# Altium project 20K Control Board V1.1.PrjPCB (part 5 of 6)

## Sheet CPU M.SchDoc
size A2
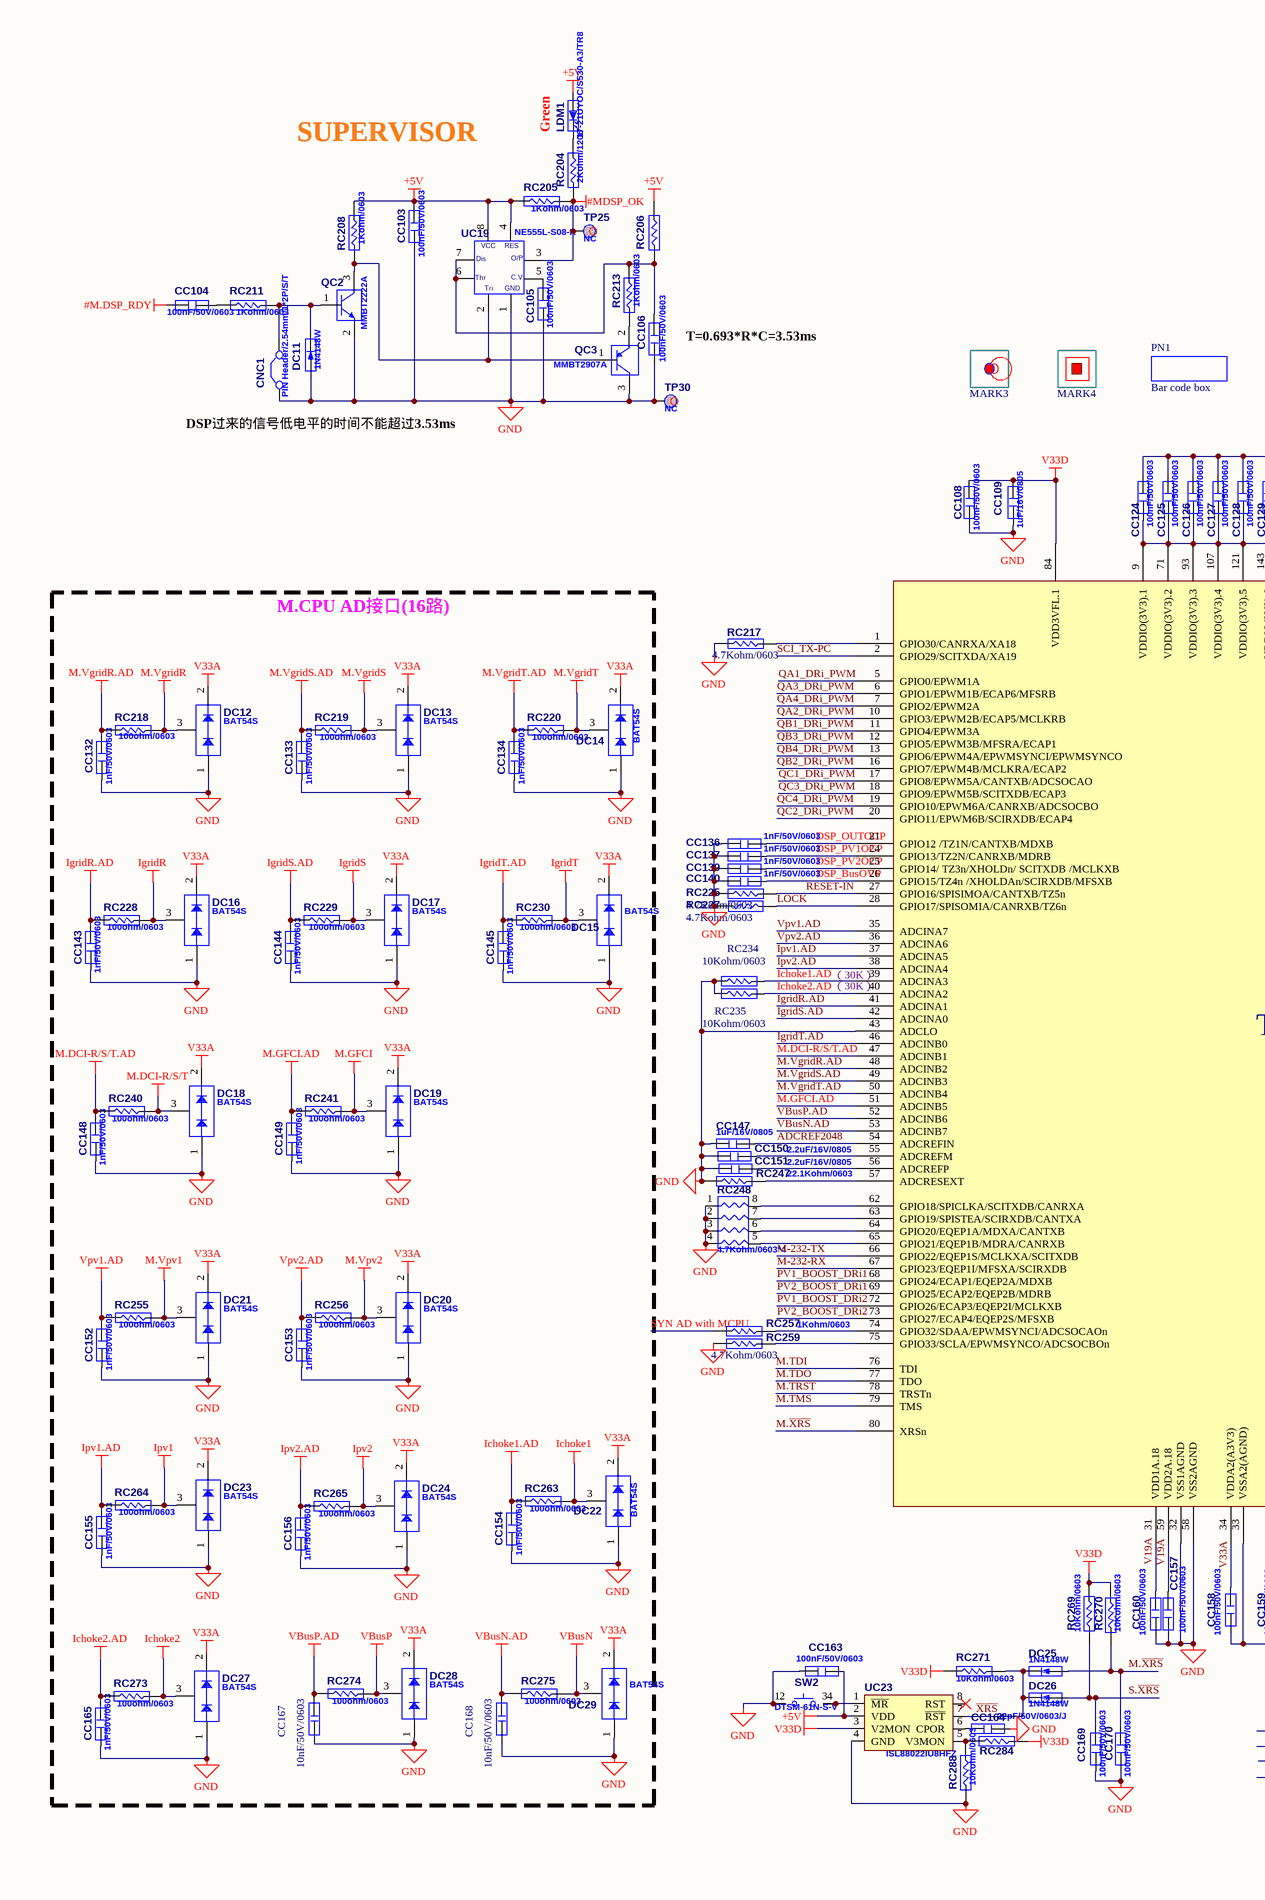
[diagram p7: CPU M.SchDoc, left]
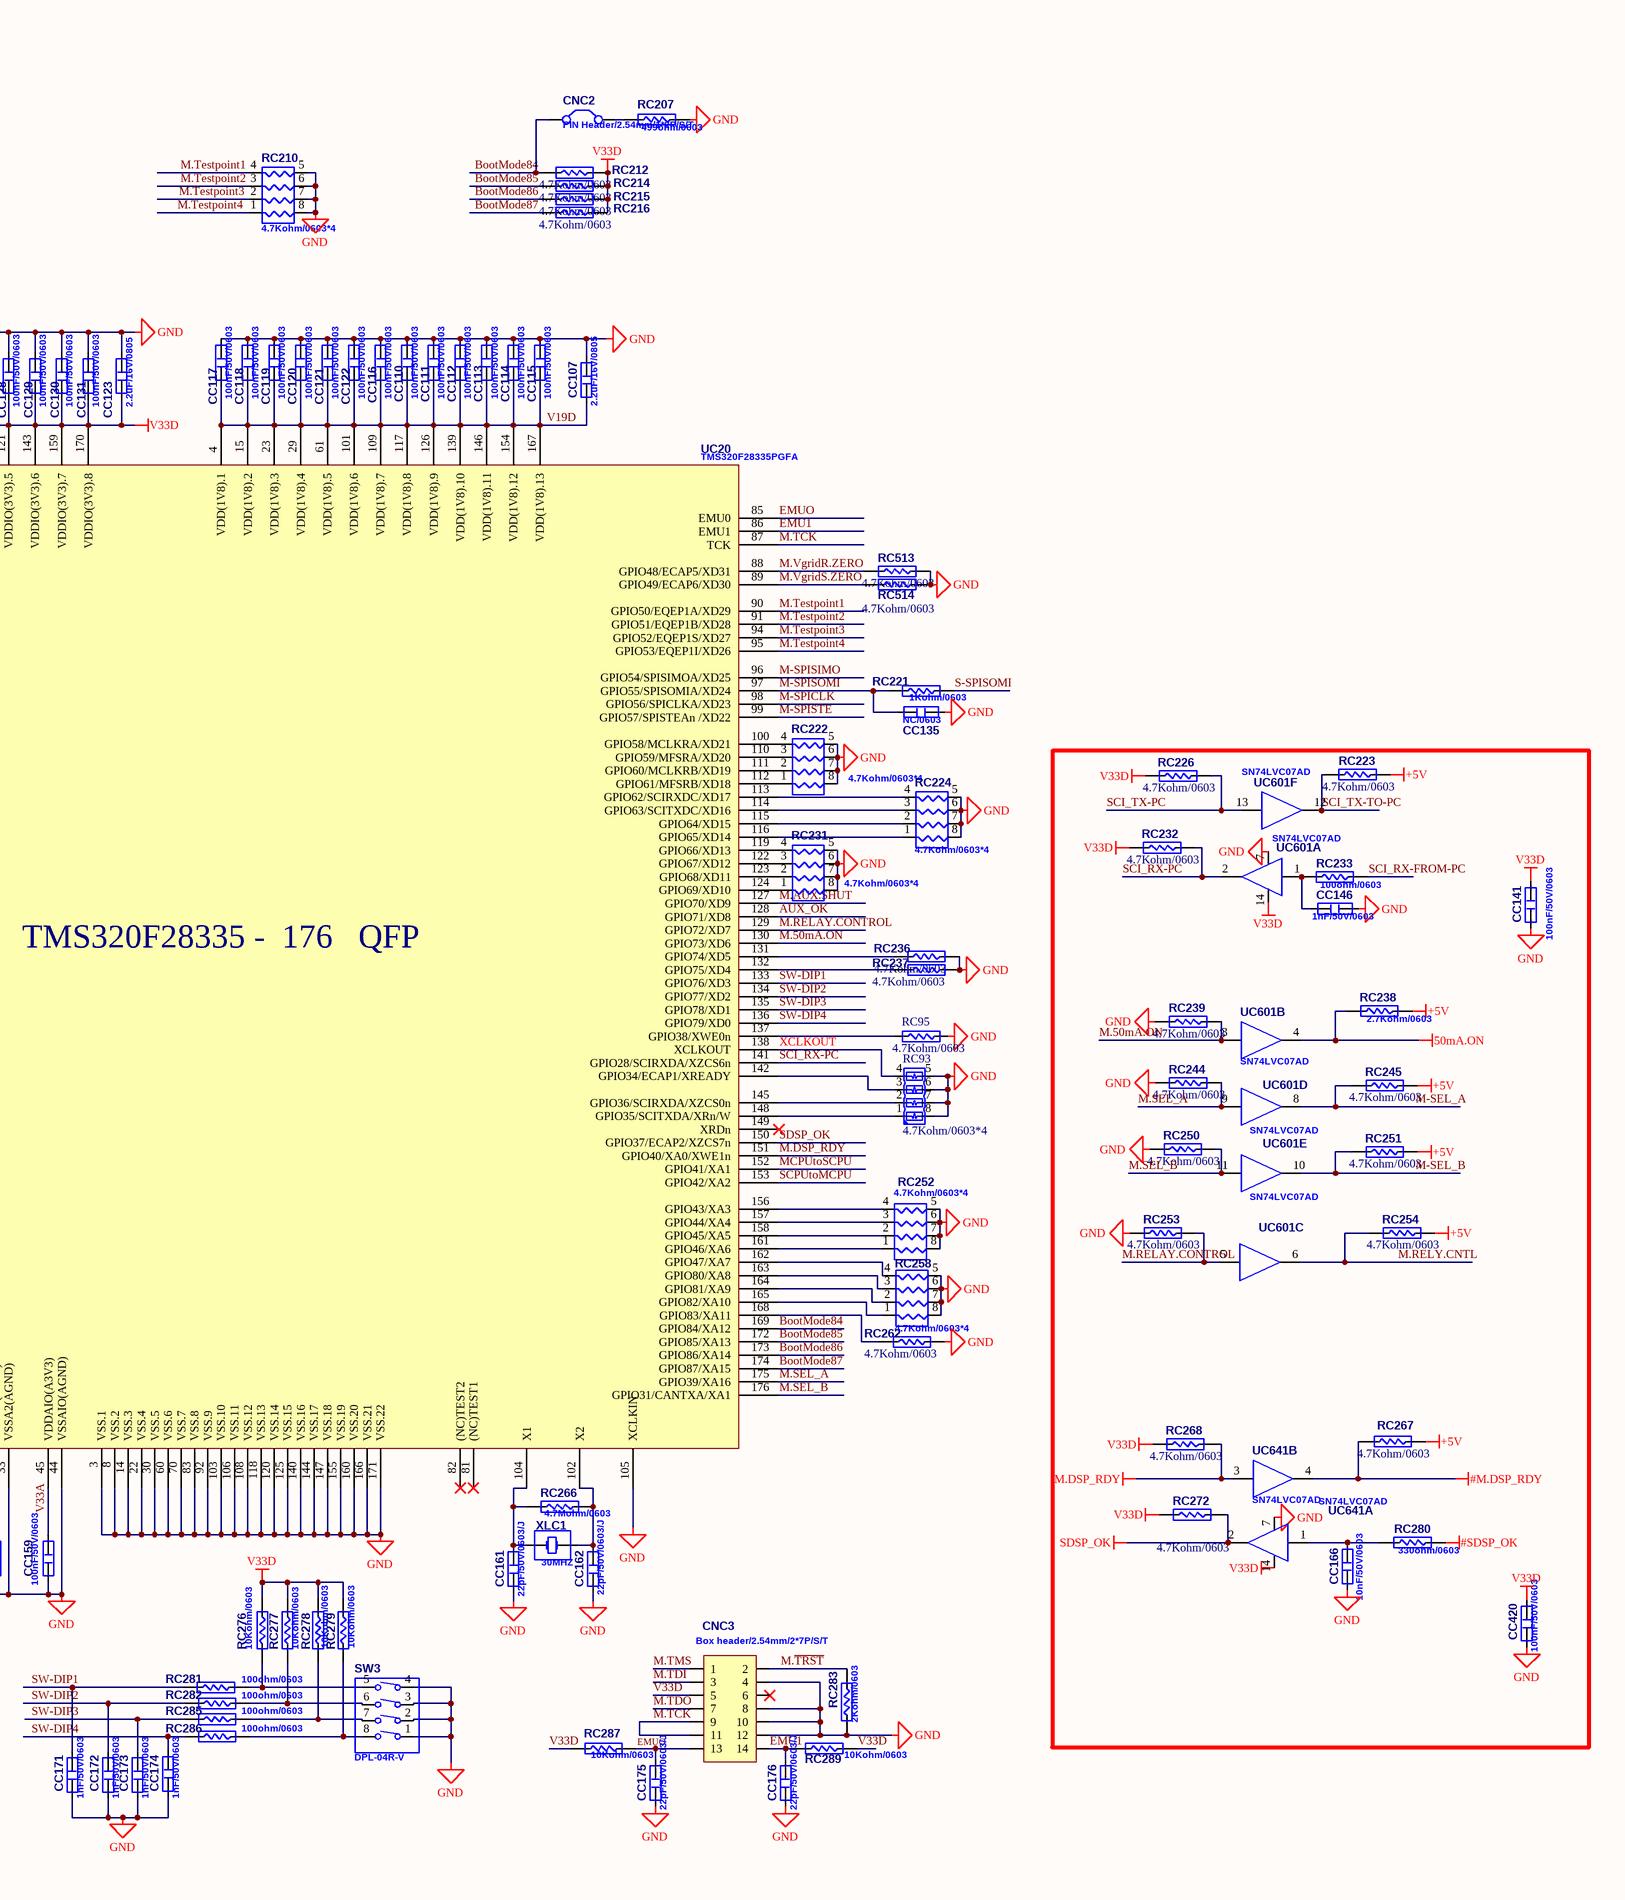
[diagram p8: CPU M.SchDoc, right]

### Parts
CC103  value 100nF/50V/0603  [CC1608-0603]  (hidden comment: 023-105220-0)
CC104  value 100nF/50V/0603  [CC1608-0603]  (hidden comment: 023-105220-0)
CC105  value 100nF/50V/0603  [CC1608-0603]  (hidden comment: 023-105220-0)
CC106  value 100nF/50V/0603  [CC1608-0603]  (hidden comment: 023-105220-0)
CC107  value 2.2uF/16V/0805  [CC2012-0805]  (hidden comment: 023-225330-0)
CC108  value 100nF/50V/0603  [CC1608-0603]  (hidden comment: 023-105220-0)
CC109  value 1uF/16V/0805  [CC2012-0805]  (hidden comment: 023-105330-0)
CC110  value 100nF/50V/0603  [CC1608-0603]  (hidden comment: 023-105220-0)
CC111  value 100nF/50V/0603  [CC1608-0603]  (hidden comment: 023-105220-0)
CC112  value 100nF/50V/0603  [CC1608-0603]  (hidden comment: 023-105220-0)
CC113  value 100nF/50V/0603  [CC1608-0603]  (hidden comment: 023-105220-0)
CC114  value 100nF/50V/0603  [CC1608-0603]  (hidden comment: 023-105220-0)
CC115  value 100nF/50V/0603  [CC1608-0603]  (hidden comment: 023-105220-0)
CC116  value 100nF/50V/0603  [CC1608-0603]  (hidden comment: 023-105220-0)
CC117  value 100nF/50V/0603  [CC1608-0603]  (hidden comment: 023-105220-0)
CC118  value 100nF/50V/0603  [CC1608-0603]  (hidden comment: 023-105220-0)
CC119  value 100nF/50V/0603  [CC1608-0603]  (hidden comment: 023-105220-0)
CC120  value 100nF/50V/0603  [CC1608-0603]  (hidden comment: 023-105220-0)
CC121  value 100nF/50V/0603  [CC1608-0603]  (hidden comment: 023-105220-0)
CC122  value 100nF/50V/0603  [CC1608-0603]  (hidden comment: 023-105220-0)
CC123  value 2.2uF/16V/0805  [CC2012-0805]  (hidden comment: 023-225330-0)
CC124  value 100nF/50V/0603  [CC1608-0603]  (hidden comment: 023-105220-0)
CC125  value 100nF/50V/0603  [CC1608-0603]  (hidden comment: 023-105220-0)
CC126  value 100nF/50V/0603  [CC1608-0603]  (hidden comment: 023-105220-0)
CC127  value 100nF/50V/0603  [CC1608-0603]  (hidden comment: 023-105220-0)
CC128  value 100nF/50V/0603  [CC1608-0603]  (hidden comment: 023-105220-0)
CC129  value 100nF/50V/0603  [CC1608-0603]  (hidden comment: 023-105220-0)
CC130  value 100nF/50V/0603  [CC1608-0603]  (hidden comment: 023-105220-0)
CC131  value 100nF/50V/0603  [CC1608-0603]  (hidden comment: 023-105220-0)
CC132  value 1nF/50V/0603  [CC1608-0603]  (hidden comment: 023-102220-0)
CC133  value 1nF/50V/0603  [CC1608-0603]  (hidden comment: 023-102220-0)
CC134  value 1nF/50V/0603  [CC1608-0603]  (hidden comment: 023-102220-0)
CC135  NC/0603  [CC1608-0603]
CC136  value 1nF/50V/0603  [CC1608-0603]  (hidden comment: 023-102220-0)
CC137  value 1nF/50V/0603  [CC1608-0603]  (hidden comment: 023-102220-0)
CC139  value 1nF/50V/0603  [CC1608-0603]  (hidden comment: 023-102220-0)
CC140  value 1nF/50V/0603  [CC1608-0603]  (hidden comment: 023-102220-0)
CC141  value 100nF/50V/0603  [CC1608-0603]  (hidden comment: 023-105220-0)
CC143  value 1nF/50V/0603  [CC1608-0603]  (hidden comment: 023-102220-0)
CC144  value 1nF/50V/0603  [CC1608-0603]  (hidden comment: 023-102220-0)
CC145  value 1nF/50V/0603  [CC1608-0603]  (hidden comment: 023-102220-0)
CC146  value 1nF/50V/0603  [CC1608-0603]  (hidden comment: 023-102220-0)
CC147  value 1uF/16V/0805  [CC2012-0805]  (hidden comment: 023-105330-0)
CC148  value 1nF/50V/0603  [CC1608-0603]  (hidden comment: 023-102220-0)
CC149  value 1nF/50V/0603  [CC1608-0603]  (hidden comment: 023-102220-0)
CC150  value 2.2uF/16V/0805  [CC2012-0805]  (hidden comment: 023-225330-0)
CC151  value 2.2uF/16V/0805  [CC2012-0805]  (hidden comment: 023-225330-0)
CC152  value 1nF/50V/0603  [CC1608-0603]  (hidden comment: 023-102220-0)
CC153  value 1nF/50V/0603  [CC1608-0603]  (hidden comment: 023-102220-0)
CC154  value 1nF/50V/0603  [CC1608-0603]  (hidden comment: 023-102220-0)
CC155  value 1nF/50V/0603  [CC1608-0603]  (hidden comment: 023-102220-0)
CC156  value 1nF/50V/0603  [CC1608-0603]  (hidden comment: 023-102220-0)
CC157  value 100nF/50V/0603  [CC1608-0603]  (hidden comment: 023-105220-0)
CC158  value 100nF/50V/0603  [CC1608-0603]  (hidden comment: 023-105220-0)
CC159  value 100nF/50V/0603  [CC1608-0603]  (hidden comment: 023-105220-0)
CC160  value 100nF/50V/0603  [CC1608-0603]  (hidden comment: 023-105220-0)
CC161  value 22pF/50V/0603/J  [CC1608-0603]  (hidden comment: 023-220220-0)
CC162  value 22pF/50V/0603/J  [CC1608-0603]  (hidden comment: 023-220220-0)
CC163  value 100nF/50V/0603  [CC1608-0603]  (hidden comment: 023-105220-0)
CC164  value 22pF/50V/0603/J  [CC1608-0603]  (hidden comment: 023-220220-0)
CC165  value 1nF/50V/0603  [CC1608-0603]  (hidden comment: 023-102220-0)
CC166  value 10nF/50V/0603  [CC1608-0603]  (hidden comment: 023-103220-0)
CC167  value 10nF/50V/0603  [C0603SM]  (hidden comment: 023-103220-0)
CC168  value 10nF/50V/0603  [C0603SM]  (hidden comment: 023-103220-0)
CC169  value 100nF/50V/0603  [CC1608-0603]  (hidden comment: 023-105220-0)
CC170  value 100nF/50V/0603  [CC1608-0603]  (hidden comment: 023-105220-0)
CC171  value 1nF/50V/0603  [CC1608-0603]  (hidden comment: 023-102220-0)
CC172  value 1nF/50V/0603  [CC1608-0603]  (hidden comment: 023-102220-0)
CC173  value 1nF/50V/0603  [CC1608-0603]  (hidden comment: 023-102220-0)
CC174  value 1nF/50V/0603  [CC1608-0603]  (hidden comment: 023-102220-0)
CC175  value 22pF/50V/0603/J  [CC1608-0603]  (hidden comment: 023-220220-0)
CC176  value 22pF/50V/0603/J  [CC1608-0603]  (hidden comment: 023-220220-0)
CC420  value 100nF/50V/0603  [CC1608-0603]  (hidden comment: 023-105220-0)
CNC1  value PIN Header/2.54mm/1*2P/S/T  [CN-SIP2.54-2P]  (hidden comment: 110-300001-0)
CNC2  value PIN Header/2.54mm/1*2P/S/T  [CN-SIP2.54-2P]  (hidden comment: 110-300001-0)
CNC3  value Box header/2.54mm/2*7P/S/T  [CN2.54-2*7P]  (hidden comment: 110-100000-0)
DC11  value 1N4148W  [SOD-123]  (hidden comment: 060-500010-0)
DC12  value BAT54S  [SOT-23]  (hidden comment: 060-510000-0)
DC13  value BAT54S  [SOT-23]  (hidden comment: 060-510000-0)
DC14  value BAT54S  [SOT-23]  (hidden comment: 060-510000-0)
DC15  value BAT54S  [SOT-23]  (hidden comment: 060-510000-0)
DC16  value BAT54S  [SOT-23]  (hidden comment: 060-510000-0)
DC17  value BAT54S  [SOT-23]  (hidden comment: 060-510000-0)
DC18  value BAT54S  [SOT-23]  (hidden comment: 060-510000-0)
DC19  value BAT54S  [SOT-23]  (hidden comment: 060-510000-0)
DC20  value BAT54S  [SOT-23]  (hidden comment: 060-510000-0)
DC21  value BAT54S  [SOT-23]  (hidden comment: 060-510000-0)
DC22  value BAT54S  [SOT-23]  (hidden comment: 060-510000-0)
DC23  value BAT54S  [SOT-23]  (hidden comment: 060-510000-0)
DC24  value BAT54S  [SOT-23]  (hidden comment: 060-510000-0)
DC25  value 1N4148W  [SOD-123]  (hidden comment: 060-500010-0)
DC26  value 1N4148W  [SOD-123]  (hidden comment: 060-500010-0)
DC27  value BAT54S  [SOT-23]  (hidden comment: 060-510000-0)
DC28  value BAT54S  [SOT-23]  (hidden comment: 060-510000-0)
DC29  value BAT54S  [SOT-23]  (hidden comment: 060-510000-0)
LDM1  value 17-21UYOC/S530-A3/TR8  [LED2012-0805SM]  (hidden comment: 060-010010-0)
MARK3  NC  [MARK_A]  (value not drawn)
MARK4  NC  [MARK_B]  (value not drawn)
PN1  Bar code box  [Bar code box]
QC2  value MMBT2222A  [SOT-23]  (hidden comment: 061-010000-0)
QC3  value MMBT2907A  [SOT-23]  (hidden comment: 061-110000-0)
RC93  value 4.7Kohm/0603*4  [R0603SM*4]  (hidden comment: 019-472000-0)
RC95  value 4.7Kohm/0603  [R0603SM]  (hidden comment: 011-472020-0)
RC204  value 2Kohm/1206  [R3216-1206]  (hidden comment: 011-202050-0)
RC205  value 1Kohm/0603  [R1608-0603]  (hidden comment: 011-102020-0)
RC206  011-493020-0  [R1608-0603]  (value not drawn)
RC207  value 499ohm/0603  [R1608-0603]  (hidden comment: 011-491020-0)
RC208  value 1Kohm/0603  [R1608-0603]  (hidden comment: 011-102020-0)
RC210  value 4.7Kohm/0603*4  [RN0603*4]  (hidden comment: 019-472000-0)
RC211  value 1Kohm/0603  [R1608-0603]  (hidden comment: 011-102020-0)
RC212  value 4.7Kohm/0603  [R1608-0603]  (hidden comment: 011-472020-0)
RC213  value 1Kohm/0603  [R1608-0603]  (hidden comment: 011-102020-0)
RC214  value 4.7Kohm/0603  [R1608-0603]  (hidden comment: 011-472020-0)
RC215  value 4.7Kohm/0603  [R1608-0603]  (hidden comment: 011-472020-0)
RC216  value 4.7Kohm/0603  [R1608-0603]  (hidden comment: 011-472020-0)
RC217  value 4.7Kohm/0603  [R1608-0603]  (hidden comment: 011-472020-0)
RC218  value 100ohm/0603  [R1608-0603]  (hidden comment: 011-101020-0)
RC219  value 100ohm/0603  [R1608-0603]  (hidden comment: 011-101020-0)
RC220  value 100ohm/0603  [R1608-0603]  (hidden comment: 011-101020-0)
RC221  value 1Kohm/0603  [R1608-0603]  (hidden comment: 011-102020-0)
RC222  value 4.7Kohm/0603*4  [RN0603*4]  (hidden comment: 019-472000-0)
RC223  value 4.7Kohm/0603  [R1608-0603]  (hidden comment: 011-472020-0)
RC224  value 4.7Kohm/0603*4  [RN0603*4]  (hidden comment: 019-472000-0)
RC225  value 4.7Kohm/0603  [R1608-0603]  (hidden comment: 011-472020-0)
RC226  value 4.7Kohm/0603  [R1608-0603]  (hidden comment: 011-472020-0)
RC227  value 4.7Kohm/0603  [R1608-0603]  (hidden comment: 011-472020-0)
RC228  value 100ohm/0603  [R1608-0603]  (hidden comment: 011-101020-0)
RC229  value 100ohm/0603  [R1608-0603]  (hidden comment: 011-101020-0)
RC230  value 100ohm/0603  [R1608-0603]  (hidden comment: 011-101020-0)
RC231  value 4.7Kohm/0603*4  [RN0603*4]  (hidden comment: 019-472000-0)
RC232  value 4.7Kohm/0603  [R1608-0603]  (hidden comment: 011-472020-0)
RC233  value 100ohm/0603  [R1608-0603]  (hidden comment: 011-101020-0)
RC234  value 10Kohm/0603  [R0603SM]  (hidden comment: 011-103020-0)
RC235  value 10Kohm/0603  [R0603SM]  (hidden comment: 011-103020-0)
RC236  value 4.7Kohm/0603  [R1608-0603]  (hidden comment: 011-472020-0)
RC237  value 4.7Kohm/0603  [R1608-0603]  (hidden comment: 011-472020-0)
RC238  value 2.7Kohm/0603  [R1608-0603]  (hidden comment: 011-272020-0)
RC239  value 4.7Kohm/0603  [R1608-0603]  (hidden comment: 011-472020-0)
RC240  value 100ohm/0603  [R1608-0603]  (hidden comment: 011-101020-0)
RC241  value 100ohm/0603  [R1608-0603]  (hidden comment: 011-101020-0)
RC244  value 4.7Kohm/0603  [R1608-0603]  (hidden comment: 011-472020-0)
RC245  value 4.7Kohm/0603  [R1608-0603]  (hidden comment: 011-472020-0)
RC247  value 22.1Kohm/0603  [R1608-0603]  (hidden comment: 011-223020-0)
RC248  value 4.7Kohm/0603*4  [RN0603*4]  (hidden comment: 019-472000-0)
RC250  value 4.7Kohm/0603  [R1608-0603]  (hidden comment: 011-472020-0)
RC251  value 4.7Kohm/0603  [R1608-0603]  (hidden comment: 011-472020-0)
RC252  value 4.7Kohm/0603*4  [RN0603*4]  (hidden comment: 019-472000-0)
RC253  value 4.7Kohm/0603  [R1608-0603]  (hidden comment: 011-472020-0)
RC254  value 4.7Kohm/0603  [R1608-0603]  (hidden comment: 011-472020-0)
RC255  value 100ohm/0603  [R1608-0603]  (hidden comment: 011-101020-0)
RC256  value 100ohm/0603  [R1608-0603]  (hidden comment: 011-101020-0)
RC257  value 1Kohm/0603  [R1608-0603]  (hidden comment: 011-102020-0)
RC258  value 4.7Kohm/0603*4  [RN0603*4]  (hidden comment: 019-472000-0)
RC259  value 4.7Kohm/0603  [R1608-0603]  (hidden comment: 011-472020-0)
RC262  value 4.7Kohm/0603  [R1608-0603]  (hidden comment: 011-472020-0)
RC263  value 100ohm/0603  [R1608-0603]  (hidden comment: 011-101020-0)
RC264  value 100ohm/0603  [R1608-0603]  (hidden comment: 011-101020-0)
RC265  value 100ohm/0603  [R1608-0603]  (hidden comment: 011-101020-0)
RC266  value 4.7Mohm/0603  [R1608-0603]  (hidden comment: 011-475020-0)
RC267  value 4.7Kohm/0603  [R1608-0603]  (hidden comment: 011-472020-0)
RC268  value 4.7Kohm/0603  [R1608-0603]  (hidden comment: 011-472020-0)
RC269  value 10Kohm/0603  [R1608-0603]  (hidden comment: 011-103020-0)
RC270  value 10Kohm/0603  [R1608-0603]  (hidden comment: 011-103020-0)
RC271  value 10Kohm/0603  [R1608-0603]  (hidden comment: 011-103020-0)
RC272  value 4.7Kohm/0603  [R1608-0603]  (hidden comment: 011-472020-0)
RC273  value 100ohm/0603  [R1608-0603]  (hidden comment: 011-101020-0)
RC274  value 100ohm/0603  [R1608-0603]  (hidden comment: 011-101020-0)
RC275  value 100ohm/0603  [R1608-0603]  (hidden comment: 011-101020-0)
RC276  value 10Kohm/0603  [R1608-0603]  (hidden comment: 011-103020-0)
RC277  value 10Kohm/0603  [R1608-0603]  (hidden comment: 011-103020-0)
RC278  value 10Kohm/0603  [R1608-0603]  (hidden comment: 011-103020-0)
RC279  value 10Kohm/0603  [R1608-0603]  (hidden comment: 011-103020-0)
RC280  value 330ohm/0603  [R1608-0603]  (hidden comment: 011-331020-0)
RC281  value 100ohm/0603  [R1608-0603]  (hidden comment: 011-101020-0)
RC282  value 100ohm/0603  [R1608-0603]  (hidden comment: 011-101020-0)
RC283  value 2Kohm/0603  [R1608-0603]  (hidden comment: 011-202020-0)
RC284  011-493020-0  [R1608-0603]  (value not drawn)
RC285  value 100ohm/0603  [R1608-0603]  (hidden comment: 011-101020-0)
RC286  value 100ohm/0603  [R1608-0603]  (hidden comment: 011-101020-0)
RC287  value 10Kohm/0603  [R1608-0603]  (hidden comment: 011-103020-0)
RC288  value 10Kohm/0603  [R1608-0603]  (hidden comment: 011-103020-0)
RC289  value 10Kohm/0603  [R1608-0603]  (hidden comment: 011-103020-0)
RC513  value 4.7Kohm/0603  [R1608-0603]  (hidden comment: 011-472020-0)
RC514  value 4.7Kohm/0603  [R1608-0603]  (hidden comment: 011-472020-0)
SW2  value DTSM-61N-S-V  [SW DTSM-6]  (hidden comment: 073-200000-0)
SW3  value DPL-04R-V  [SW-DIP4]  (hidden comment: 073-010000-0)
TP25  NC  [TEST-12]
TP30  NC  [TEST-12]
UC19  value NE555L-S08-R  [SO8]  (hidden comment: 050-512010-0)
UC20  value TMS320F28335PGFA  [SQFP-176]  (hidden comment: 050-410211-0)
UC23  value ISL88022IU8HFZ  [MSOP-8M]  (hidden comment: 050-412210-0)
UC601  value SN74LVC07AD  [SO14]  (hidden comment: 050-510011-0)  (parts A,B,C,D,E,F of 6)
UC641  value SN74LVC07AD  [SO14]  (hidden comment: 050-510011-0)  (parts A,B of 6)
XLC1  value 30MHZ  [XL49TSM_1]  (hidden comment: 100-100000-0)

### Blocks framed on the sheet
M.CPU AD接口(16路): CC132-CC134 CC143-CC145 CC148 CC149 CC152-CC156 CC165 CC167 CC168 DC12-DC24 DC27-DC29 RC218-RC220 RC228-RC230 RC240 RC241 RC255 RC256 RC263-RC265 RC273-RC275

### Nets
50mA.ON: RC238.1 UC601.4
#M.DSP_RDY: CC104.2 RC267.1 UC641.4
#MDSP_OK: RC204.1 RC205.2 TP25.1 UC19.3
#SDSP_OK: RC280.1
+5V: CC103.1 CC163.2 LDM1.1 RC205.1 RC206.2 RC208.1 RC223.1 RC238.2 RC245.2 RC251.2 RC254.2 RC267.2 UC19.4 UC19.8(VCC) UC23.2(VDD)
ADCREF2048: CC147.2 UC20.54(ADCREFIN)
AUX_OK: UC20.128(GPIO71/XD8)
DSP_OUTOCP: CC136.2 UC20.21(GPIO12_/TZ1N/CANTXB/MDXB)
GND: CC103.2 CC105.2 CC106.2 CC107.2 CC108.1 CC109.1 CC110.2 CC111.2 CC112.2 CC113.2 CC114.2 CC115.2 CC116.2 CC117.2 CC118.2 CC119.2 CC120.2 CC121.2 CC122.2 CC123.2 CC124.2 CC125.2 CC126.2 CC127.2 CC128.2 CC129.2 CC130.2 CC131.2 CC132.1 CC133.1 CC134.1 CC135.1 CC136.1 CC137.1 CC139.1 CC140.1 CC141.1 CC143.1 CC144.1 CC145.1 CC146.2 CC147.1 CC148.1 CC149.1 CC150.1 CC151.1 CC152.1 CC153.1 CC154.1 CC155.1 CC156.1 CC157.1 CC158.1 CC159.1 CC160.1 CC161.1 CC162.1 CC163.1 CC164.2 CC165.1 CC166.2 CC167.1 CC168.1 CC169.1 CC170.1 CC171.1 CC172.1 CC173.1 CC174.1 CC175.1 CC176.1 CC420.2 CNC1.1(C1) CNC3.4 CNC3.8 CNC3.10 CNC3.12 DC11.1 DC12.1 DC13.1 DC14.1 DC15.1 DC16.1 DC17.1 DC18.1 DC19.1 DC20.1 DC21.1 DC22.1 DC23.1 DC24.1 DC27.1 DC28.1 DC29.1 QC2.2 QC3.3 RC93.5 RC93.6 RC93.7 RC93.8 RC95.2 RC207.1 RC210.5 RC210.6 RC210.7 RC210.8 RC217.1 RC222.5 RC222.6 RC222.7 RC222.8 RC224.5 RC224.6 RC224.7 RC224.8 RC225.1 RC227.2 RC231.5 RC231.6 RC231.7 RC231.8 RC234.1 RC235.1 RC236.2 RC237.2 RC239.1 RC244.1 RC247.1 RC248.1 RC248.2 RC248.3 RC248.4 RC250.1 RC252.5 RC252.6 RC252.7 RC252.8 RC253.1 RC258.5 RC258.6 RC258.7 RC258.8 RC259.1 RC262.2 RC283.1 RC288.1 RC513.2 RC514.2 SW2.1 SW2.2 SW3.1 SW3.2 SW3.3 SW3.4 TP30.1 UC19.1(GND) UC20.3(VSS.1) UC20.8(VSS.2) UC20.14(VSS.3) UC20.22(VSS.4) UC20.30(VSS.5) UC20.32(VSS1AGND) UC20.33(VSSA2(AGND)) UC20.43(ADCLO) UC20.44(VSSAIO(AGND)) UC20.58(VSS2AGND) UC20.60(VSS.6) UC20.70(VSS.7) UC20.83(VSS.8) UC20.92(VSS.9) UC20.103(VSS.10) UC20.105(XCLKIN) UC20.106(VSS.11) UC20.108(VSS.12) UC20.118(VSS.13) UC20.120(VSS.14) UC20.125(VSS.15) UC20.140(VSS.16) UC20.144(VSS.17) UC20.147(VSS.18) UC20.155(VSS.19) UC20.160(VSS.20) UC20.166(VSS.21) UC20.171(VSS.22) UC23.4(GND) UC601.7 UC641.7 XLC1.2 XLC1.4
Ichoke1: DC22.3 RC263.1
Ichoke1.AD: CC154.2 RC234.2 RC263.2 UC20.39(ADCINA3)
Ichoke2: DC27.3 RC273.1
Ichoke2.AD: CC165.2 RC235.2 RC273.2 UC20.40(ADCINA2)
IgridR: DC16.3 RC228.1
IgridR.AD: CC143.2 RC228.2 UC20.41(ADCINA1)
IgridS: DC17.3 RC229.1
IgridS.AD: CC144.2 RC229.2 UC20.42(ADCINA0)
IgridT: DC15.3 RC230.1
IgridT.AD: CC145.2 RC230.2 UC20.46(ADCINB0)
Ipv1: DC23.3 RC264.1
Ipv1.AD: CC155.2 RC264.2 UC20.37(ADCINA5)
Ipv2: DC24.3 RC265.1
Ipv2.AD: CC156.2 RC265.2 UC20.38(ADCINA4)
M.DCI-R/S/T: DC18.3 RC240.1
M.DCI-R/S/T.AD: CC148.2 RC240.2 UC20.47(ADCINB1)
M.DSP_RDY: RC268.2 UC20.151(GPIO40/XA0/XWE1n) UC641.3
M.GFCI: DC19.3 RC241.1
M.GFCI.AD: CC149.2 RC241.2 UC20.51(ADCINB5)
M.VgridR: DC12.3 RC218.1
M.VgridR.AD: CC132.2 RC218.2 UC20.48(ADCINB2)
M.VgridS: DC13.3 RC219.1
M.VgridS.AD: CC133.2 RC219.2 UC20.49(ADCINB3)
M.VgridT: DC14.3 RC220.1
M.VgridT.AD: CC134.2 RC220.2 UC20.50(ADCINB4)
M.Vpv1: DC21.3 RC255.1
M.Vpv2: DC20.3 RC256.1
SDSP_OK: RC272.2 UC20.150(GPIO37/ECAP2/XZCS7n) UC641.2
V19A: CC157.2 CC160.2 UC20.31(VDD1A.18) UC20.59(VDD2A.18)
V19D: CC107.1 CC110.1 CC111.1 CC112.1 CC113.1 CC114.1 CC115.1 CC116.1 CC117.1 CC118.1 CC119.1 CC120.1 CC121.1 CC122.1 UC20.4(VDD(1V8).1) UC20.15(VDD(1V8).2) UC20.23(VDD(1V8).3) UC20.29(VDD(1V8).4) UC20.61(VDD(1V8).5) UC20.101(VDD(1V8).6) UC20.109(VDD(1V8).7) UC20.117(VDD(1V8).8) UC20.126(VDD(1V8).9) UC20.139(VDD(1V8).10) UC20.146(VDD(1V8).11) UC20.154(VDD(1V8).12) UC20.167(VDD(1V8).13)
V33A: CC158.2 CC159.2 DC12.2 DC13.2 DC14.2 DC15.2 DC16.2 DC17.2 DC18.2 DC19.2 DC20.2 DC21.2 DC22.2 DC23.2 DC24.2 DC27.2 DC28.2 DC29.2 UC20.34(VDDA2(A3V3)) UC20.45(VDDAIO(A3V3))
V33D: CC108.2 CC109.2 CC123.1 CC124.1 CC125.1 CC126.1 CC127.1 CC128.1 CC129.1 CC130.1 CC131.1 CC141.2 CC420.1 CNC3.5 RC212.2 RC214.2 RC215.2 RC216.2 RC226.1 RC232.1 RC268.1 RC269.2 RC270.2 RC271.1 RC272.1 RC276.2 RC277.2 RC278.2 RC279.2 RC284.1 RC287.2 RC289.1 UC20.9(VDDIO(3V3).1) UC20.71(VDDIO(3V3).2) UC20.84(VDD3VFL.1) UC20.93(VDDIO(3V3).3) UC20.107(VDDIO(3V3).4) UC20.121(VDDIO(3V3).5) UC20.143(VDDIO(3V3).6) UC20.159(VDDIO(3V3).7) UC20.170(VDDIO(3V3).8) UC23.3(V2MON) UC601.14 UC641.14
VBusN: DC29.3 RC275.1
VBusN.AD: CC168.2 RC275.2 UC20.53(ADCINB7)
VBusP: DC28.3 RC274.1
VBusP.AD: CC167.2 RC274.2 UC20.52(ADCINB6)
Vpv1.AD: CC152.2 RC255.2 UC20.35(ADCINA7)
Vpv2.AD: CC153.2 RC256.2 UC20.36(ADCINA6)
BootMode84: CNC2.1(C1) RC212.1 UC20.169(GPIO84/XA12)
BootMode85: RC214.1 UC20.172(GPIO85/XA13)
BootMode86: RC215.1 UC20.173(GPIO86/XA14)
BootMode87: RC216.1 UC20.174(GPIO87/XA15)
DSP_BusOVP: CC140.2 UC20.26(GPIO15/TZ4n_/XHOLDAn/SCIRXDB/MFSXB)
DSP_PV1OCP: CC137.2 UC20.24(GPIO13/TZ2N/CANRXB/MDRB)
DSP_PV2OCP: CC139.2 UC20.25(GPIO14/_TZ3n/XHOLDn/_SCITXDB_/MCLKXB)
EMU1: CC176.2 CNC3.14 RC289.2 UC20.86(EMU1)
EMUO: CC175.2 CNC3.13 RC287.1 UC20.85(EMU0)
LOCK: RC227.1 UC20.28(GPIO17/SPISOMIA/CANRXB/TZ6n)
M-232-RX: UC20.67(GPIO23/EQEP1I/MFSXA/SCIRXDB)
M-232-TX: UC20.66(GPIO22/EQEP1S/MCLKXA/SCITXDB)
M-SEL_A: RC245.1 UC601.8
M-SEL_B: RC251.1 UC601.10
M-SPICLK: UC20.98(GPIO56/SPICLKA/XD23)
M-SPISIMO: UC20.96(GPIO54/SPISIMOA/XD25)
M-SPISOMI: CC135.2 RC221.1 UC20.97(GPIO55/SPISOMIA/XD24)
M-SPISTE: UC20.99(GPIO57/SPISTEAn_/XD22)
M.50mA.ON: RC239.2 UC20.130(GPIO73/XD6) UC601.3
M.AUX.SHUT: UC20.127(GPIO70/XD9)
M.RELAY.CONTROL: RC253.2 UC20.129(GPIO72/XD7) UC601.5
M.RELY.CNTL: RC254.1 UC601.6
M.SEL_A: RC244.2 UC20.175(GPIO39/XA16) UC601.9
M.SEL_B: RC250.2 UC20.176(GPIO31/CANTXA/XA1) UC601.11
M.~{TRST}: CNC3.2 RC283.2 UC20.78(TRSTn)
M.TCK: CNC3.9 CNC3.11 UC20.87(TCK)
M.TDI: CNC3.3 UC20.76(TDI)
M.TDO: CNC3.7 UC20.77(TDO)
M.Testpoint1: RC210.4 UC20.90(GPIO50/EQEP1A/XD29)
M.Testpoint2: RC210.3 UC20.91(GPIO51/EQEP1B/XD28)
M.Testpoint3: RC210.2 UC20.94(GPIO52/EQEP1S/XD27)
M.Testpoint4: RC210.1 UC20.95(GPIO53/EQEP1I/XD26)
M.TMS: CNC3.1 UC20.79(TMS)
M.VgridR.ZERO: RC513.1 UC20.88(GPIO48/ECAP5/XD31)
M.VgridS.ZERO: RC514.1 UC20.89(GPIO49/ECAP6/XD30)
M.~{XRS}: CC170.2 DC25.1 RC270.1 UC20.80(XRSn)
MCPUtoSCPU: UC20.152(GPIO41/XA1)
PV1_BOOST_DRi1: UC20.68(GPIO24/ECAP1/EQEP2A/MDXB)
PV1_BOOST_DRi2: UC20.72(GPIO26/ECAP3/EQEP2I/MCLKXB)
PV2_BOOST_DRi1: UC20.69(GPIO25/ECAP2/EQEP2B/MDRB)
PV2_BOOST_DRi2: UC20.73(GPIO27/ECAP4/EQEP2S/MFSXB)
QA1_DRi_PWM: UC20.5(GPIO0/EPWM1A)
QA2_DRi_PWM: UC20.10(GPIO3/EPWM2B/ECAP5/MCLKRB)
QA3_DRi_PWM: UC20.6(GPIO1/EPWM1B/ECAP6/MFSRB)
QA4_DRi_PWM: UC20.7(GPIO2/EPWM2A)
QB1_DRi_PWM: UC20.11(GPIO4/EPWM3A)
QB2_DRi_PWM: UC20.16(GPIO7/EPWM4B/MCLKRA/ECAP2)
QB3_DRi_PWM: UC20.12(GPIO5/EPWM3B/MFSRA/ECAP1)
QB4_DRi_PWM: UC20.13(GPIO6/EPWM4A/EPWMSYNCI/EPWMSYNCO)
QC1_DRi_PWM: UC20.17(GPIO8/EPWM5A/CANTXB/ADCSOCAO)
QC2_DRi_PWM: UC20.20(GPIO11/EPWM6B/SCIRXDB/ECAP4)
QC3_DRi_PWM: UC20.18(GPIO9/EPWM5B/SCITXDB/ECAP3)
QC4_DRi_PWM: UC20.19(GPIO10/EPWM6A/CANRXB/ADCSOCBO)
RESET-IN: RC225.2 UC20.27(GPIO16/SPISIMOA/CANTXB/TZ5n)
S-SPISOMI: RC221.2
S.~{XRS}: CC169.2 DC26.1 RC269.1
SCI_RX-FROM-PC: RC233.1
SCI_RX-PC: RC232.2 UC20.141(GPIO28/SCIRXDA/XZCS6n) UC601.2
SCI_TX-PC: RC226.2 UC20.2(GPIO29/SCITXDA/XA19) UC601.13
SCI_TX-TO-PC: RC223.2 UC601.12
SCPUtoMCPU: UC20.153(GPIO42/XA2)
SW-DIP1: CC171.2 RC281.2 UC20.133(GPIO76/XD3)
SW-DIP2: CC172.2 RC282.2 UC20.134(GPIO77/XD2)
SW-DIP3: CC173.2 RC285.2 UC20.135(GPIO78/XD1)
SW-DIP4: CC174.2 RC286.2 UC20.136(GPIO79/XD0)
SYN AD with MCPU: RC257.1
~{XRS}: DC25.2 DC26.2 RC271.2 UC23.7(~{RST})
XCLKOUT: RC93.4 UC20.138(XCLKOUT)
NetCC104_1: CC104.1 RC211.1
NetCC105_1: CC105.1 UC19.5
NetCC106_1: CC106.1 RC206.1 RC213.2 UC19.6 UC19.7
NetCC146_1: CC146.1 RC233.2 UC601.1
NetCC150_2: CC150.2 UC20.55(ADCREFM)
NetCC151_2: CC151.2 UC20.56(ADCREFP)
NetCC161_2: CC161.2 RC266.1 UC20.104(X1) XLC1.1
NetCC162_2: CC162.2 RC266.2 UC20.102(X2) XLC1.3
NetCC164_1: CC164.1 UC23.6(CPOR)
NetCC166_1: CC166.1 RC280.2 UC641.1
NetCNC1_2: CNC1.2(C2) DC11.2 QC2.1 RC211.2
NetCNC2_2: CNC2.2(C2) RC207.2
NetLDM1_2: LDM1.2 RC204.2
NetQC2_3: QC2.3 QC3.1 RC208.2 UC19.2
NetQC3_2: QC3.2 RC213.1
NetRC93_1: RC93.1 UC20.148(GPIO35/SCITXDA/XRn/W)
NetRC93_2: RC93.2 UC20.145(GPIO36/SCIRXDA/XZCS0n)
NetRC93_3: RC93.3 UC20.142(GPIO34/ECAP1/XREADY)
NetRC95_1: RC95.1 UC20.137(GPIO38/XWE0n)
NetRC217_2: RC217.2 UC20.1(GPIO30/CANRXA/XA18)
NetRC222_1: RC222.1 UC20.112(GPIO61/MFSRB/XD18)
NetRC222_2: RC222.2 UC20.111(GPIO60/MCLKRB/XD19)
NetRC222_3: RC222.3 UC20.110(GPIO59/MFSRA/XD20)
NetRC222_4: RC222.4 UC20.100(GPIO58/MCLKRA/XD21)
NetRC224_1: RC224.1 UC20.116(GPIO65/XD14)
NetRC224_2: RC224.2 UC20.115(GPIO64/XD15)
NetRC224_3: RC224.3 UC20.114(GPIO63/SCITXDC/XD16)
NetRC224_4: RC224.4 UC20.113(GPIO62/SCIRXDC/XD17)
NetRC231_1: RC231.1 UC20.124(GPIO69/XD10)
NetRC231_2: RC231.2 UC20.123(GPIO68/XD11)
NetRC231_3: RC231.3 UC20.122(GPIO67/XD12)
NetRC231_4: RC231.4 UC20.119(GPIO66/XD13)
NetRC236_1: RC236.1 UC20.131(GPIO74/XD5)
NetRC237_1: RC237.1 UC20.132(GPIO75/XD4)
NetRC247_2: RC247.2 UC20.57(ADCRESEXT)
NetRC248_5: RC248.5 UC20.65(GPIO21/EQEP1B/MDRA/CANRXB)
NetRC248_6: RC248.6 UC20.64(GPIO20/EQEP1A/MDXA/CANTXB)
NetRC248_7: RC248.7 UC20.63(GPIO19/SPISTEA/SCIRXDB/CANTXA)
NetRC248_8: RC248.8 UC20.62(GPIO18/SPICLKA/SCITXDB/CANRXA)
NetRC252_1: RC252.1 UC20.161(GPIO46/XA6)
NetRC252_2: RC252.2 UC20.158(GPIO45/XA5)
NetRC252_3: RC252.3 UC20.157(GPIO44/XA4)
NetRC252_4: RC252.4 UC20.156(GPIO43/XA3)
NetRC257_2: RC257.2 UC20.74(GPIO32/SDAA/EPWMSYNCI/ADCSOCAOn)
NetRC258_1: RC258.1 UC20.165(GPIO82/XA10)
NetRC258_2: RC258.2 UC20.164(GPIO81/XA9)
NetRC258_3: RC258.3 UC20.163(GPIO80/XA8)
NetRC258_4: RC258.4 UC20.162(GPIO47/XA7)
NetRC259_2: RC259.2 UC20.75(GPIO33/SCLA/EPWMSYNCO/ADCSOCBOn)
NetRC262_1: RC262.1 UC20.168(GPIO83/XA11)
NetRC276_1: RC276.1 RC281.1 SW3.5
NetRC277_1: RC277.1 RC282.1 SW3.6
NetRC278_1: RC278.1 RC285.1 SW3.7
NetRC279_1: RC279.1 RC286.1 SW3.8
NetRC284_2: RC284.2 RC288.2 UC23.5(V3MON)
NetSW2_3: SW2.3 SW2.4 UC23.1(~{MR})

Not connected (* = marked no-connect by the designer): CNC3 6*; UC20 81((NC)TEST1)* 82((NC)TEST2)* 149(XRDn)*; UC23 8(RST)*

### Notes on the sheet
- SUPERVISOR
- Green
- (near CC106) T=0.693*R*C=3.53ms
- (near CNC1) DSP过来的信号低电平的时间不能超过3.53ms
- (near UC20) （30K）
- (in symbol IC 555SM) RES; Dis; O/P; Thr; C.V; Tri
- (in symbol P176TSM) TMS320F28335 -  176   QFP

### Library data of the parts
CC103-CC106 CC108 CC110-CC122 CC124-CC131 CC141 CC157-CC160 CC163 CC169 CC170 CC420 = C0603 SM: 100nF/50V/J/X7R/0603
CC107 CC123 CC150 CC151 = C0805 SM: 2.2uF/16V/K/X7R/0805
CC109 CC147 = C0805 SM: 1uF/16V/K/X7R/0805
CC132-CC134 CC136 CC137 CC139 CC140 CC143-CC146 CC148 CC149 CC152-CC156 CC165 CC171-CC174 = C0603 SM: 1nF/50V/J/C0G/0603
CC135 = C0603 SM: PN: 023-221220-0; Value: NC/0603
CC161 CC162 CC164 CC175 CC176 = C0603 SM: 22pF/50V/J/C0G/0603
CC166 = C0603 SM: 10nF/50V/J/X7R/0603
CC167 CC168 = 023-103220-0 C0603SM: 10nF/50V/J/X7R/0603; Name of Material: 陶瓷电容; Vendor: 三星/YAGEO; Assembly type: 贴片; PN: 023-103220-0
CNC1 CNC2 = JP05P02: PIN Header/2.54mm/1*2P/S/T; Type: 插件
CNC3 = CN2.54-2*7P: Box header/2.54mm/2*7P/S/T; Vendor: 广联威; Part Type: THD
DC11 DC25 DC26 = D 1N4148W: 0.15A/75V/SOD-123; Type: 插件
DC12-DC24 DC27-DC29 = BAT54S: 0.2A/30V/SOT-23
LDM1 = LD0805SM: 2.0*1.25*0.75mm/Orange
MARK3 = MARK_A: 单位: PCS; H: MM; Value: NC
MARK4 = MARK_B: 单位: PCS; H: MM; Value: NC
QC2 = TR 2222SM: 0.6A/40VDC/SOT-23
QC3 = TR 2907SM: 0.6A/60VDC/SOT-23
RC93 = 019-472000-0 R0603SM*4: 4.7Kohm/J/0603*4; Name of Material: 厚膜晶片排阻; Vendor: RALEC; Factory model: RTA03-4D4K7JTP; Assembly type: 贴片; PN: 019-472000-0
RC95 = 011-472020-0 R0603SM: 4.7Kohm/1/10W/F/0603; Name of Material: 厚膜电阻; Vendor: RALEC/YAGEO; Factory model: RTT03 4K7F TP/RC0603FR-074K7L; Assembly type: 贴片; PN: 011-472020-0
RC204 = R1206SM: 2Kohm/1/4W/F/1206
RC205 RC208 RC211 RC213 RC221 RC257 = R0603SM: 1Kohm/1/10W/F/0603
RC206 RC284 = R0603SM: 49.9Kohm/1/10W/F/0603; Value: 49.9Kohm/0603
RC207 = R0603SM: 499ohm/1/10W/F/0603
RC210 RC222 RC224 RC231 RC248 RC252 RC258 = R0603*4SM: 4.7Kohm/J/0603*4
RC212 RC214-RC217 RC223 RC225-RC227 RC232 RC236 RC237 RC239 RC244 RC245 RC250 RC251 RC253 RC254 RC259 RC262 RC267 RC268 RC272 RC513 RC514 = R0603SM: 4.7Kohm/1/10W/F/0603
RC218-RC220 RC228-RC230 RC233 RC240 RC241 RC255 RC256 RC263-RC265 RC273-RC275 RC281 RC282 RC285 RC286 = R0603SM: 100ohm/1/10W/F/0603
RC234 RC235 = 011-103020-0 R0603SM: 10Kohm/1/10W/F/0603; Name of Material: 厚膜电阻; Vendor: RALEC/YAGEO; Factory model: RTT03 10KF TP/RC0603FR-0710KL; Assembly type: 贴片; PN: 011-103020-0
RC238 = R0603SM: 2.7Kohm/1/10W/F/0603
RC247 = R0603SM: 22.1Kohm/1/10W/F/0603
RC266 = R0603SM: 4.7Mohm/1/10W/F/0603
RC269-RC271 RC276-RC279 RC287-RC289 = R0603SM: 10Kohm/1/10W/F/0603
RC280 = R0603SM: 330ohm/1/10W/F/0603
RC283 = R0603SM: 2Kohm/1/10W/F/0603
SW2 = 17KDTSM-6: 6*6*4.3mm/Brown/160gf; Type: 贴片
SW3 = SW-DIP4: DPL-04R-V/DIP; Part Type: THD
TP25 TP30 = 17K TPD: Type: 插件; Value: NC
UC19 = IC 555SM: NE555 Single Timer/SOP-8
UC20 = P176TSM: Digital Signal Controller/LQFP-176
UC23 = 17KISL88021: Triple Voltage Monitor/MSOP-8; Type: 贴片
UC601 UC641 = 17K IC SN74LVC07AD: Hex Buffer/Driver/SOIC-14; Type: 贴片
XLC1 = XL49TSM_1: 30MHZ/20pF/±30ppm/5.0*3.2
PN1 = Bar code box: Value: Bar code box

## Sheet IO.SchDoc
size A2
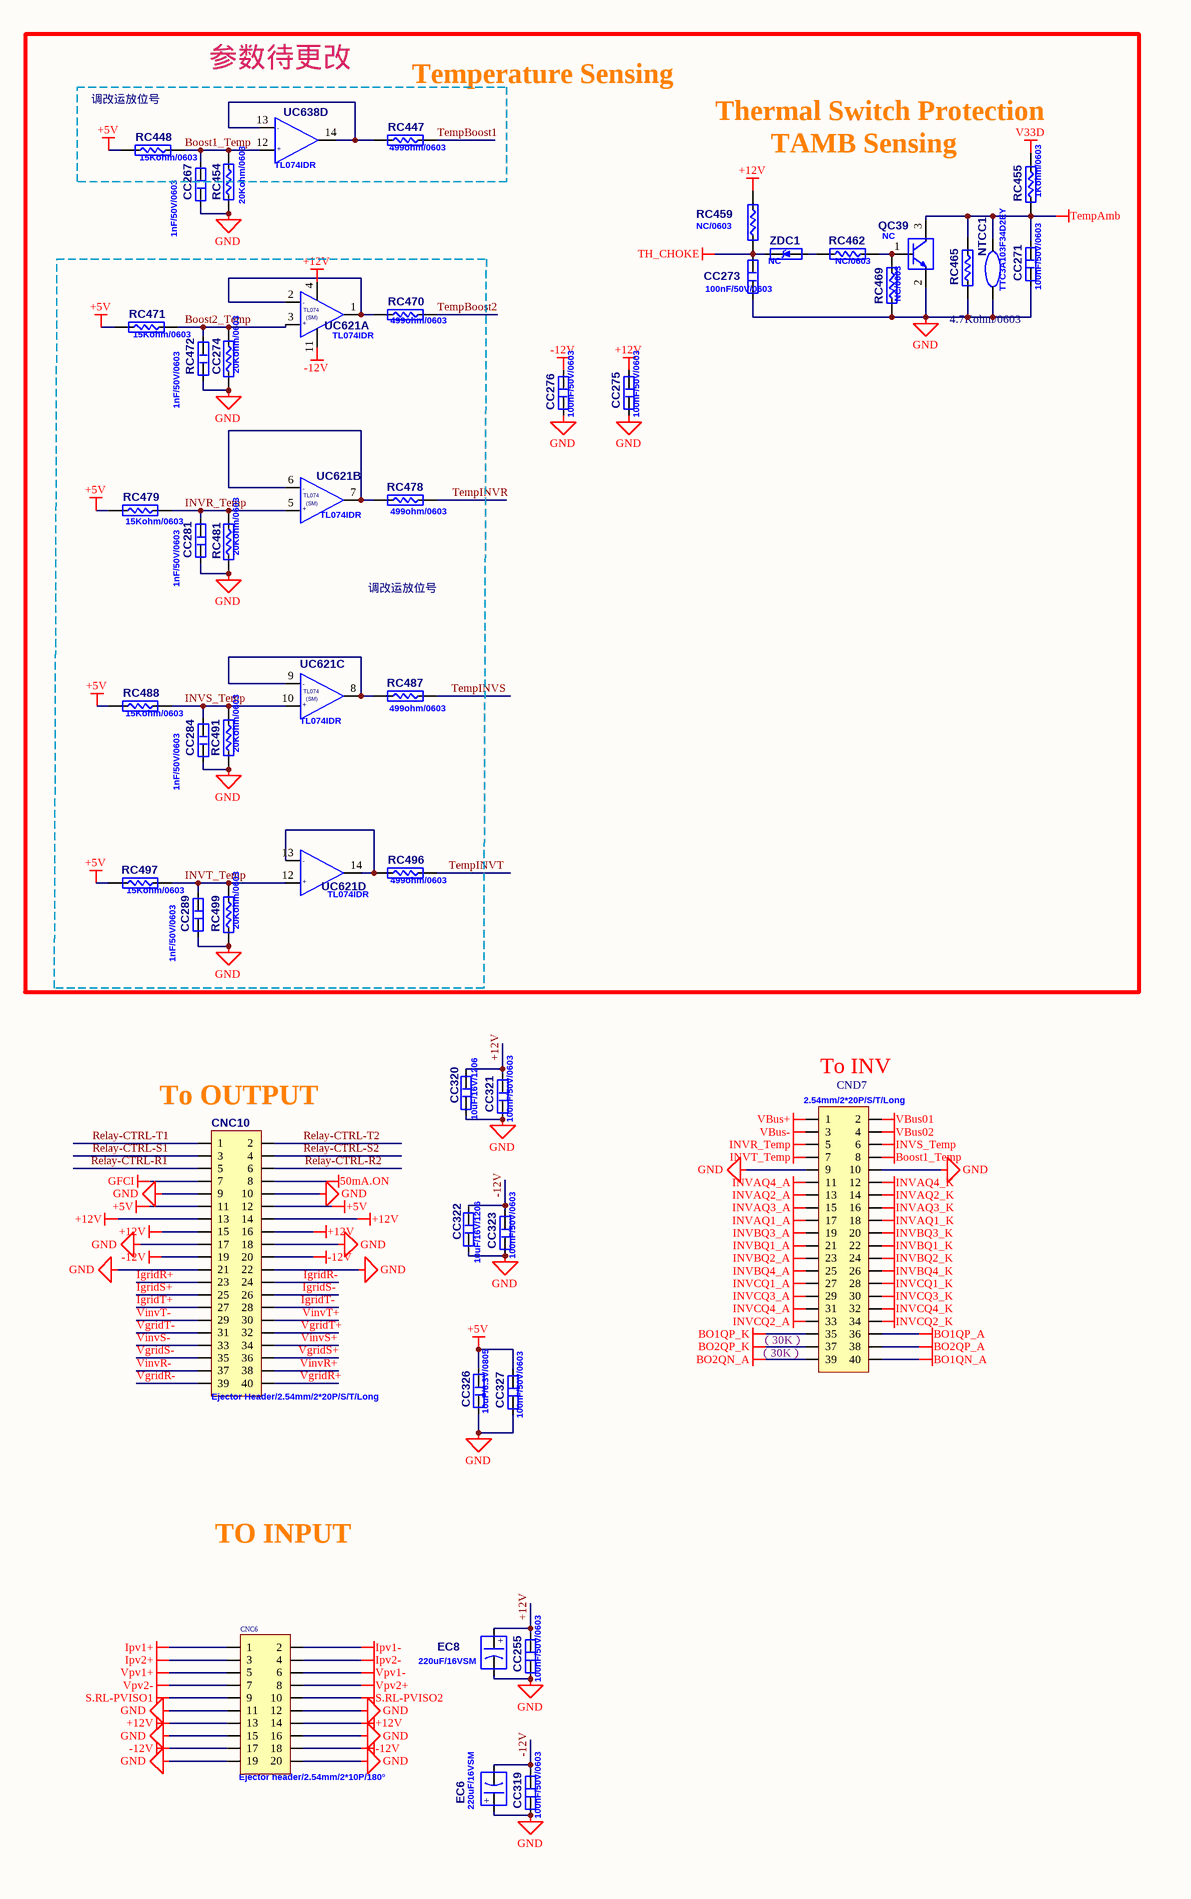
[diagram p9: IO.SchDoc, left]
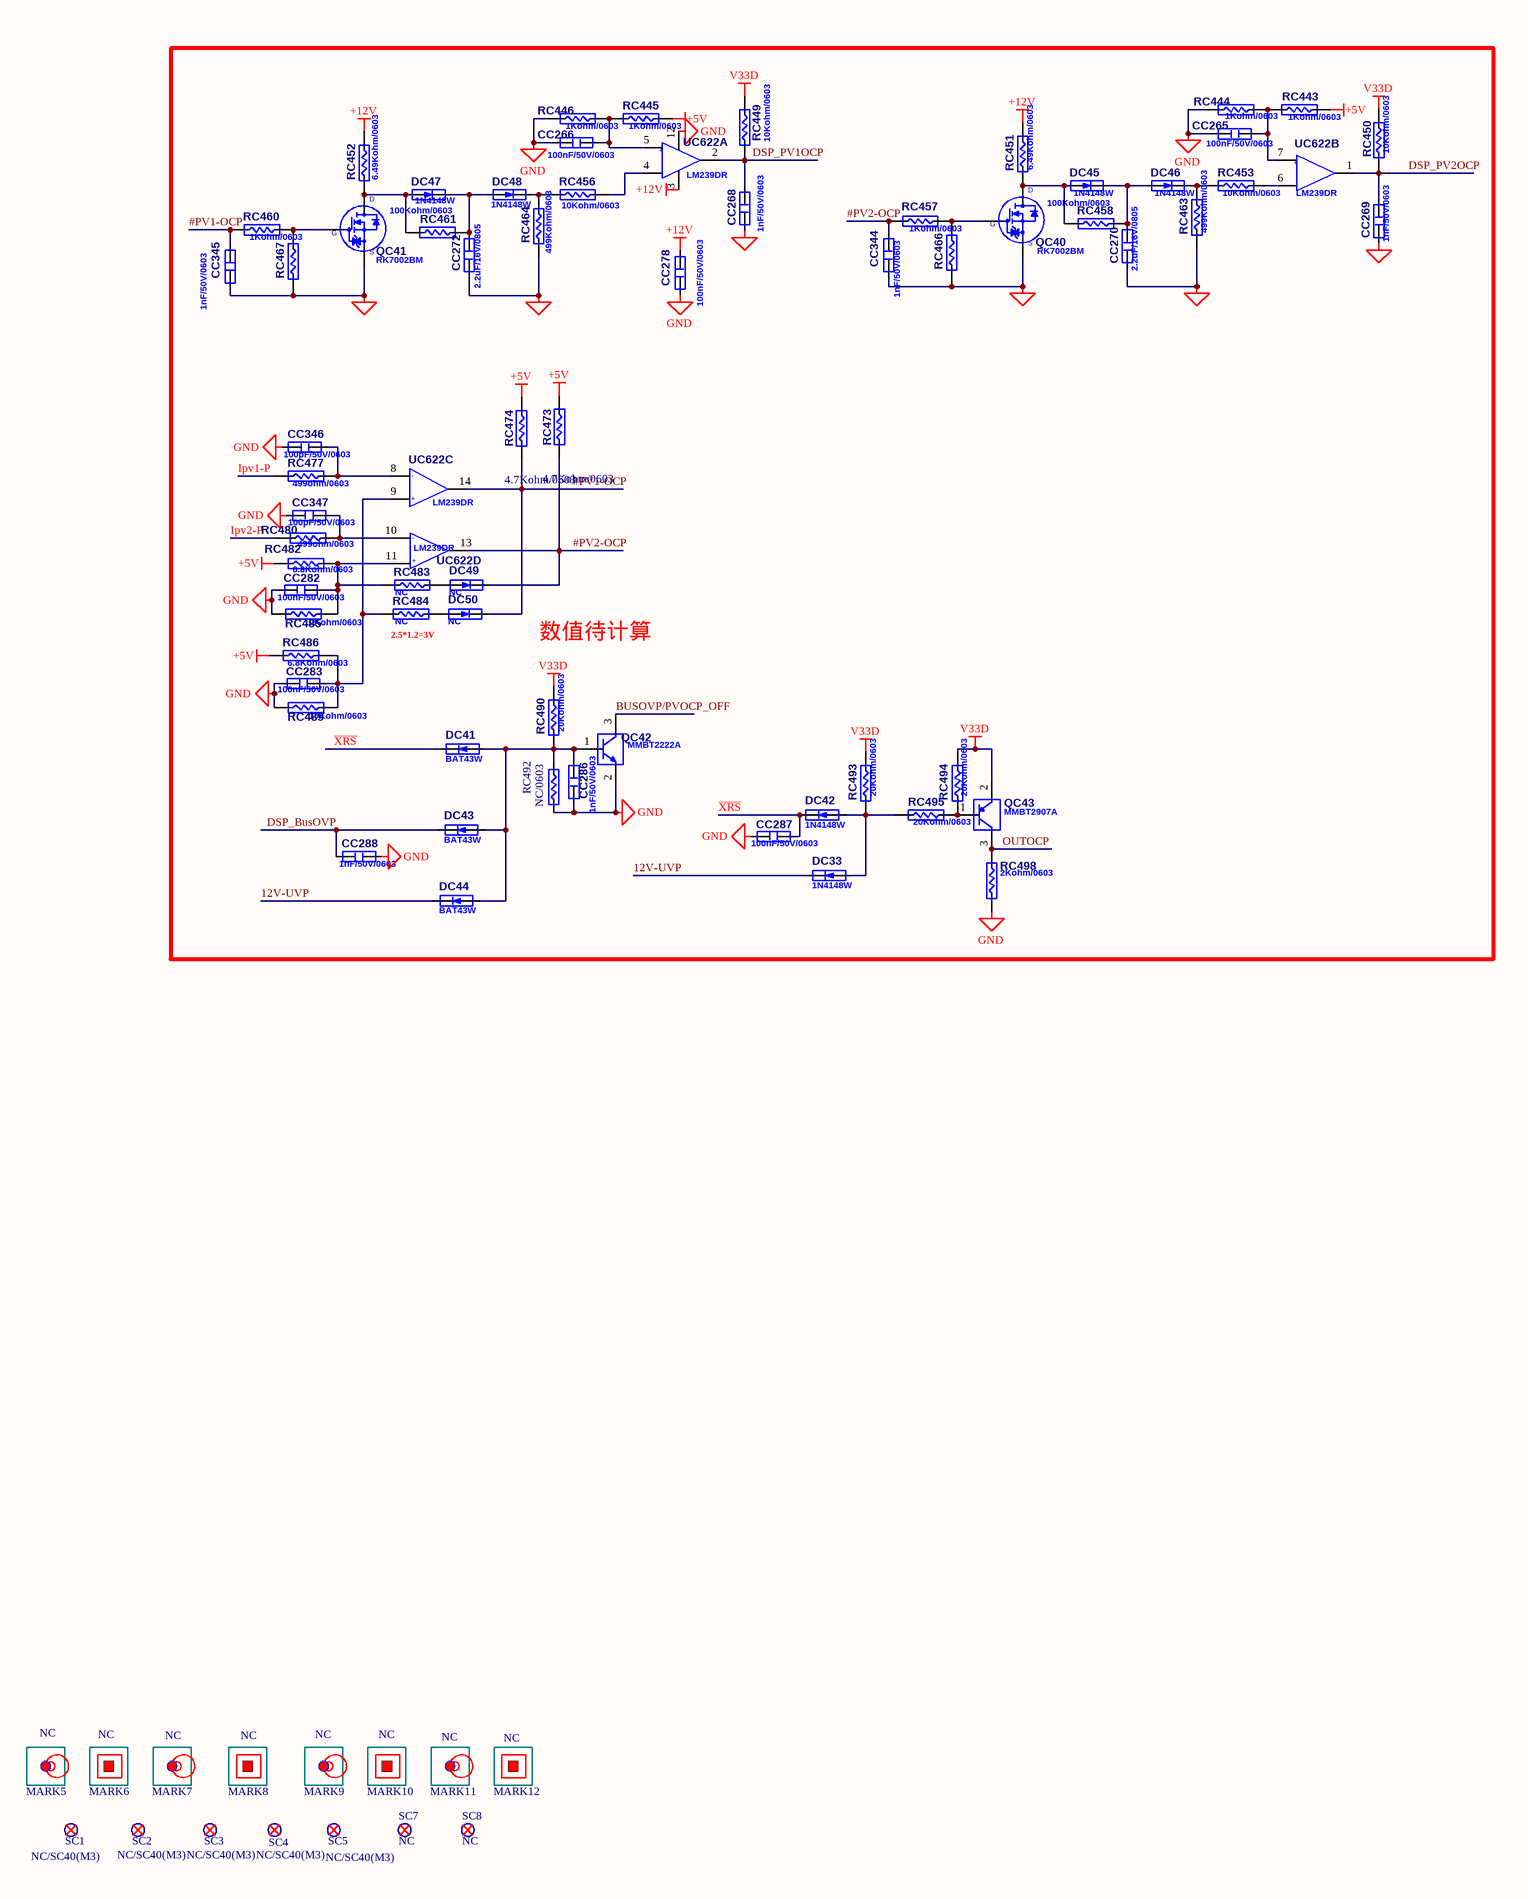
[diagram p10: IO.SchDoc, right]

### Parts
CC255  value 100nF/50V/0603  [CC1608-0603]  (hidden comment: 023-105220-0)
CC265  value 100nF/50V/0603  [CC1608-0603]  (hidden comment: 023-105220-0)
CC266  value 100nF/50V/0603  [CC1608-0603]  (hidden comment: 023-105220-0)
CC267  value 1nF/50V/0603  [CC1608-0603]  (hidden comment: 023-102220-0)
CC268  value 1nF/50V/0603  [CC1608-0603]  (hidden comment: 023-102220-0)
CC269  value 1nF/50V/0603  [CC1608-0603]  (hidden comment: 023-102220-0)
CC270  value 2.2uF/16V/0805  [CC2012-0805]  (hidden comment: 023-225330-0)
CC271  value 100nF/50V/0603  [CC1608-0603]  (hidden comment: 023-105220-0)
CC272  value 2.2uF/16V/0805  [CC2012-0805]  (hidden comment: 023-225330-0)
CC273  value 100nF/50V/0603  [CC1608-0603]  (hidden comment: 023-105220-0)
CC274  value 1nF/50V/0603  [CC1608-0603]  (hidden comment: 023-102220-0)
CC275  value 100nF/50V/0603  [CC1608-0603]  (hidden comment: 023-105220-0)
CC276  value 100nF/50V/0603  [CC1608-0603]  (hidden comment: 023-105220-0)
CC278  value 100nF/50V/0603  [CC1608-0603]  (hidden comment: 023-105220-0)
CC281  value 1nF/50V/0603  [CC1608-0603]  (hidden comment: 023-102220-0)
CC282  value 100nF/50V/0603  [CC1608-0603]  (hidden comment: 023-105220-0)
CC283  value 100nF/50V/0603  [CC1608-0603]  (hidden comment: 023-105220-0)
CC284  value 1nF/50V/0603  [CC1608-0603]  (hidden comment: 023-102220-0)
CC286  value 1nF/50V/0603  [CC1608-0603]  (hidden comment: 023-102220-0)
CC287  value 100nF/50V/0603  [CC1608-0603]  (hidden comment: 023-105220-0)
CC288  value 1nF/50V/0603  [CC1608-0603]  (hidden comment: 023-102220-0)
CC289  value 1nF/50V/0603  [CC1608-0603]  (hidden comment: 023-102220-0)
CC319  value 100nF/50V/0603  [CC1608-0603]  (hidden comment: 023-105220-0)
CC320  value 10uF/16V/1206  [CC3216-1206]  (hidden comment: 023-106350-0)
CC321  value 100nF/50V/0603  [CC1608-0603]  (hidden comment: 023-105220-0)
CC322  value 10uF/16V/1206  [CC3216-1206]  (hidden comment: 023-106350-0)
CC323  value 100nF/50V/0603  [CC1608-0603]  (hidden comment: 023-105220-0)
CC326  value 10uF/6.3V/0805  [CC2012-0805]  (hidden comment: 023-106330-0)
CC327  value 100nF/50V/0603  [CC1608-0603]  (hidden comment: 023-105220-0)
CC344  value 1nF/50V/0603  [CC1608-0603]  (hidden comment: 023-102220-0)
CC345  value 1nF/50V/0603  [CC1608-0603]  (hidden comment: 023-102220-0)
CC346  value 100pF/50V/0603  [CC1608-0603]  (hidden comment: 023-101220-0)
CC347  value 100pF/50V/0603  [CC1608-0603]  (hidden comment: 023-101220-0)
CNC6  value Ejector header/2.54mm/2*10P/180°  [CN2.54-2*10P_2]  (hidden comment: 110-103250-0)
CNC10  value Ejector Header/2.54mm/2*20P/S/T/Long  [CN2.54-2*20P]  (hidden comment: 110-310000-0)
CND7  value 2.54mm/2*20P/S/T/Long  [CN2.54-2*20P]  (hidden comment: 110-310000-0)
DC33  value 1N4148W  [SOD-123]  (hidden comment: 060-500010-0)
DC41  value BAT43W  [SOD-123]  (hidden comment: 060-310000-0)
DC42  value 1N4148W  [SOD-123]  (hidden comment: 060-500010-0)
DC43  value BAT43W  [SOD-123]  (hidden comment: 060-310000-0)
DC44  value BAT43W  [SOD-123]  (hidden comment: 060-310000-0)
DC45  value 1N4148W  [SOD-123]  (hidden comment: 060-500010-0)
DC46  value 1N4148W  [SOD-123]  (hidden comment: 060-500010-0)
DC47  value 1N4148W  [SOD-123]  (hidden comment: 060-500010-0)
DC48  value 1N4148W  [SOD-123]  (hidden comment: 060-500010-0)
DC49  NC  [SOD-123]
DC50  NC  [SOD-123]
EC6  value 220uF/16VSM  [EC220UF/16VSM-6.3]  (hidden comment: 020-227100-1)
EC8  value 220uF/16VSM  [EC220UF/16VSM-6.3]  (hidden comment: 020-227100-1)
MARK5  NC  [MARK_A]
MARK6  NC  [MARK_B]
MARK7  NC  [MARK_A]
MARK8  NC  [MARK_B]
MARK9  NC  [MARK_A]
MARK10  NC  [MARK_B]
MARK11  NC  [MARK_A]
MARK12  NC  [MARK_B]
NTCC1  value TTC3A103F34D2EY  [TTC3A103F34D2EY]  (hidden comment: 016-103000-0)
QC39  NC  [SOT-23]
QC40  value RK7002BM  [SOT-23 - 1]  (hidden comment: 063-010010-0)
QC41  value RK7002BM  [SOT-23 - 1]  (hidden comment: 063-010010-0)
QC42  value MMBT2222A  [SOT-23]  (hidden comment: 061-010000-0)
QC43  value MMBT2907A  [SOT-23]  (hidden comment: 061-110000-0)
RC443  value 1Kohm/0603  [R1608-0603]  (hidden comment: 011-102020-0)
RC444  value 1Kohm/0603  [R1608-0603]  (hidden comment: 011-102020-0)
RC445  value 1Kohm/0603  [R1608-0603]  (hidden comment: 011-102020-0)
RC446  value 1Kohm/0603  [R1608-0603]  (hidden comment: 011-102020-0)
RC447  value 499ohm/0603  [R1608-0603]  (hidden comment: 011-491020-0)
RC448  value 15Kohm/0603  [R1608-0603]  (hidden comment: 011-153020-0)
RC449  value 10Kohm/0603  [R1608-0603]  (hidden comment: 011-103020-0)
RC450  value 10Kohm/0603  [R1608-0603]  (hidden comment: 011-103020-0)
RC451  value 6.49Kohm/0603  [R1608-0603]  (hidden comment: 011-642020-0)
RC452  value 6.49Kohm/0603  [R1608-0603]  (hidden comment: 011-642020-0)
RC453  value 10Kohm/0603  [R1608-0603]  (hidden comment: 011-103020-0)
RC454  value 20Kohm/0603  [R1608-0603]  (hidden comment: 011-203020-0)
RC455  value 1Kohm/0603  [R1608-0603]  (hidden comment: 011-102020-0)
RC456  value 10Kohm/0603  [R1608-0603]  (hidden comment: 011-103020-0)
RC457  value 1Kohm/0603  [R1608-0603]  (hidden comment: 011-102020-0)
RC458  value 100Kohm/0603  [R1608-0603]  (hidden comment: 011-104020-0)
RC459  NC/0603  [R1608-0603]
RC460  value 1Kohm/0603  [R1608-0603]  (hidden comment: 011-102020-0)
RC461  value 100Kohm/0603  [R1608-0603]  (hidden comment: 011-104020-0)
RC462  NC/0603  [R1608-0603]
RC463  value 499Kohm/0603  [R1608-0603]  (hidden comment: 011-494020-0)
RC464  value 499Kohm/0603  [R1608-0603]  (hidden comment: 011-494020-0)
RC465  value 4.7Kohm/0603  [R1608-0603]  (hidden comment: 011-472020-0)
RC466  011-493020-0  [R1608-0603]  (value not drawn)
RC467  011-493020-0  [R1608-0603]  (value not drawn)
RC469  NC/0603  [R1608-0603]
RC470  value 499ohm/0603  [R1608-0603]  (hidden comment: 011-491020-0)
RC471  value 15Kohm/0603  [R1608-0603]  (hidden comment: 011-153020-0)
RC472  value 20Kohm/0603  [R1608-0603]  (hidden comment: 011-203020-0)
RC473  value 4.7Kohm/0603  [R1608-0603]  (hidden comment: 011-472020-0)
RC474  value 4.7Kohm/0603  [R1608-0603]  (hidden comment: 011-472020-0)
RC477  value 499ohm/0603  [R1608-0603]  (hidden comment: 011-491020-0)
RC478  value 499ohm/0603  [R1608-0603]  (hidden comment: 011-491020-0)
RC479  value 15Kohm/0603  [R1608-0603]  (hidden comment: 011-153020-0)
RC480  value 499ohm/0603  [R1608-0603]  (hidden comment: 011-491020-0)
RC481  value 20Kohm/0603  [R1608-0603]  (hidden comment: 011-203020-0)
RC482  value 6.8Kohm/0603  [R1608-0603]  (hidden comment: 011-682020-0)
RC483  NC  [R1608-0603]
RC484  NC  [R1608-0603]
RC485  value 10Kohm/0603  [R1608-0603]  (hidden comment: 011-103020-0)
RC486  value 6.8Kohm/0603  [R1608-0603]  (hidden comment: 011-682020-0)
RC487  value 499ohm/0603  [R1608-0603]  (hidden comment: 011-491020-0)
RC488  value 15Kohm/0603  [R1608-0603]  (hidden comment: 011-153020-0)
RC489  value 10Kohm/0603  [R1608-0603]  (hidden comment: 011-103020-0)
RC490  value 20Kohm/0603  [R1608-0603]  (hidden comment: 011-203020-0)
RC491  value 20Kohm/0603  [R1608-0603]  (hidden comment: 011-203020-0)
RC492  NC/0603  [R0603SM]
RC493  value 20Kohm/0603  [R1608-0603]  (hidden comment: 011-203020-0)
RC494  value 20Kohm/0603  [R1608-0603]  (hidden comment: 011-203020-0)
RC495  value 20Kohm/0603  [R1608-0603]  (hidden comment: 011-203020-0)
RC496  value 499ohm/0603  [R1608-0603]  (hidden comment: 011-491020-0)
RC497  value 15Kohm/0603  [R1608-0603]  (hidden comment: 011-153020-0)
RC498  value 2Kohm/0603  [R1608-0603]  (hidden comment: 011-202020-0)
RC499  value 20Kohm/0603  [R1608-0603]  (hidden comment: 011-203020-0)
SC1  NC/SC40(M3)  [SC40_M3]
SC2  NC/SC40(M3)  [SC40_M3]
SC3  NC/SC40(M3)  [SC40_M3]
SC4  NC/SC40(M3)  [SC40_M3]
SC5  NC/SC40(M3)  [SC40_M3]
SC7  NC  [SC-MC]
SC8  NC  [SC-MC]
UC621  value TL074IDR  [SO14]  (hidden comment: 050-612020-0)  (parts A,B,C,D of 4)
UC622  value LM239DR  [SO14]  (hidden comment: 050-610030-0)  (parts A,B,C,D of 4)
UC638  value TL074IDR  [SO14]  (hidden comment: 050-612020-0)  (part D of 4)
ZDC1  NC  [SOD-123]

### Blocks framed on the sheet
数值待计算: CC265 CC266 CC268-CC270 CC272 CC278 CC282 CC283 CC286-CC288 CC344-CC347 DC33 DC41-DC50 QC40-QC43 RC443-RC446 RC449-RC453 RC456-RC458 RC460 RC461 RC463 RC464 RC466 RC467 RC473 RC474 RC477 RC480 RC482-RC486 RC489 RC490 RC492-RC495 RC498 UC622
调改运放位号: CC274 CC281 CC284 CC289 RC470-RC472 RC478 RC479 RC481 RC487 RC488 RC491 RC496 RC497 RC499 UC621

### Nets
50mA.ON: CNC10.8
+5V: CC326.2 CC327.1 CNC10.11 CNC10.12 RC443.2 RC445.2 RC448.2 RC471.2 RC473.2 RC474.2 RC479.2 RC482.1 RC486.1 RC488.2 RC497.2
+12V: CC255.1 CC275.1 CC278.1 CC320.2 CC321.1 CNC6.13 CNC6.14 CNC10.13 CNC10.14 CNC10.15 CNC10.16 EC8.1 RC451.2 RC452.2 RC459.1 UC621.4 UC622.3
-12V: CC276.1 CC319.1 CC322.2 CC323.1 CNC6.17 CNC6.18 CNC10.19 CNC10.20 EC6.2 UC621.11
BO1QN_A: CND7.40
BO1QP_A: CND7.36
BO1QP_K: CND7.35
BO2QN_A: CND7.39
BO2QP_A: CND7.38
BO2QP_K: CND7.37
Boost1_Temp: CC267.1 CND7.8 RC448.1 RC454.1 UC638.12
GFCI: CNC10.7
GND: CC255.2 CC265.1 CC266.1 CC267.2 CC268.2 CC269.2 CC270.1 CC271.2 CC272.1 CC273.2 CC274.2 CC275.2 CC276.2 CC278.2 CC281.2 CC282.1 CC283.1 CC284.2 CC286.1 CC287.2 CC288.2 CC289.2 CC319.2 CC320.1 CC321.2 CC322.1 CC323.2 CC326.1 CC327.2 CC344.2 CC345.2 CC346.1 CC347.1 CNC6.11 CNC6.12 CNC6.15 CNC6.16 CNC6.19 CNC6.20 CNC10.9 CNC10.10 CNC10.17 CNC10.18 CNC10.21 CNC10.22 CND7.9 CND7.10 EC6.1 EC8.2 NTCC1.2 QC39.2 QC40.1 QC41.1 QC42.2 RC444.1 RC446.1 RC454.2 RC463.1 RC464.1 RC465.2 RC466.1 RC467.1 RC469.2 RC472.2 RC481.2 RC485.1 RC489.1 RC491.2 RC492.1 RC498.1 RC499.2 UC622.12
INVAQ1_A: CND7.17
INVAQ1_K: CND7.18
INVAQ2_A: CND7.13
INVAQ2_K: CND7.14
INVAQ3_A: CND7.15
INVAQ3_K: CND7.16
INVAQ4_A: CND7.11
INVAQ4_K: CND7.12
INVBQ1_A: CND7.21
INVBQ1_K: CND7.22
INVBQ2_A: CND7.23
INVBQ2_K: CND7.24
INVBQ3_A: CND7.19
INVBQ3_K: CND7.20
INVBQ4_A: CND7.25
INVBQ4_K: CND7.26
INVCQ1_A: CND7.27
INVCQ1_K: CND7.28
INVCQ2_A: CND7.33
INVCQ2_K: CND7.34
INVCQ3_A: CND7.29
INVCQ3_K: CND7.30
INVCQ4_A: CND7.31
INVCQ4_K: CND7.32
INVR_Temp: CC281.1 CND7.5 RC479.1 RC481.1 UC621.5
INVS_Temp: CC284.1 CND7.6 RC488.1 RC491.1 UC621.10
INVT_Temp: CC289.1 CND7.7 RC497.1 RC499.1 UC621.12
Ipv1+: CNC6.1
Ipv1-: CNC6.2
Ipv2+: CNC6.3
Ipv2-: CNC6.4
OUTOCP: QC43.3 RC498.2
S.RL-PVISO1: CNC6.9
S.RL-PVISO2: CNC6.10
TempAmb: CC271.1 NTCC1.1 QC39.3 RC455.2 RC465.1
TH_CHOKE: CC273.1 RC459.2 ZDC1.2
V33D: QC43.2 RC449.1 RC450.1 RC455.1 RC490.2 RC493.2 RC494.1
VBus01: CND7.2
VBus02: CND7.4
VBus+: CND7.1
VBus-: CND7.3
Vpv1+: CNC6.5
Vpv1-: CNC6.6
Vpv2+: CNC6.8
Vpv2-: CNC6.7
12V-UVP: DC33.2 DC44.2
#PV1-OCP: CC345.1 DC50.2 RC460.2 RC474.1 UC622.14
#PV2-OCP: CC344.1 DC49.2 RC457.2 RC473.1 UC622.13
Boost2_Temp: CC274.1 RC471.1 RC472.1 UC621.3
BUSOVP/PVOCP_OFF: QC42.3
DSP_BusOVP: CC288.1 DC43.2
DSP_PV1OCP: CC268.1 RC449.2 UC622.2
DSP_PV2OCP: CC269.1 RC450.2 UC622.1
IgridR+: CNC10.23
IgridR-: CNC10.24
IgridS+: CNC10.25
IgridS-: CNC10.26
IgridT+: CNC10.27
IgridT-: CNC10.28
Ipv1-P: RC477.1
Ipv2-P: RC480.1
Relay-CTRL-R1: CNC10.5
Relay-CTRL-R2: CNC10.6
Relay-CTRL-S1: CNC10.3
Relay-CTRL-S2: CNC10.4
Relay-CTRL-T1: CNC10.1
Relay-CTRL-T2: CNC10.2
TempBoost1: RC447.1
TempBoost2: RC470.1
TempINVR: RC478.1
TempINVS: RC487.1
TempINVT: RC496.1
VgridR+: CNC10.40
VgridR-: CNC10.39
VgridS+: CNC10.36
VgridS-: CNC10.35
VgridT+: CNC10.32
VgridT-: CNC10.31
VinvR+: CNC10.38
VinvR-: CNC10.37
VinvS+: CNC10.34
VinvS-: CNC10.33
VinvT+: CNC10.30
VinvT-: CNC10.29
~{XRS}: CC287.1 DC41.2 DC42.2
NetCC265_2: CC265.2 RC443.1 RC444.2 UC622.7
NetCC266_2: CC266.2 RC445.1 RC446.2 UC622.5
NetCC270_2: CC270.2 DC45.2 DC46.1 RC458.2
NetCC272_2: CC272.2 DC47.2 DC48.1 RC461.2
NetCC282_2: CC282.2 RC482.2 RC483.1 RC485.2 UC622.11
NetCC283_2: CC283.2 RC484.1 RC486.2 RC489.2 UC622.9
NetCC286_2: CC286.2 DC41.1 DC43.1 DC44.1 QC42.1 RC490.1 RC492.2
NetCC346_2: CC346.2 RC477.2 UC622.8
NetCC347_2: CC347.2 RC480.2 UC622.10
NetDC33_1: DC33.1 DC42.1 RC493.1 RC495.2
NetDC45_1: DC45.1 QC40.3 RC451.1 RC458.1
NetDC46_2: DC46.2 RC453.1 RC463.2
NetDC47_1: DC47.1 QC41.3 RC452.1 RC461.1
NetDC48_2: DC48.2 RC456.1 RC464.2
NetDC49_1: DC49.1 RC483.2
NetDC50_1: DC50.1 RC484.2
NetQC39_1: QC39.1 RC462.1 RC469.1
NetQC40_2: QC40.2 RC457.1 RC466.2
NetQC41_2: QC41.2 RC460.1 RC467.2
NetQC43_1: QC43.1 RC494.2 RC495.1
NetRC447_2: RC447.2 UC638.13 UC638.14
NetRC453_2: RC453.2 UC622.6
NetRC456_2: RC456.2 UC622.4
NetRC462_2: RC462.2 ZDC1.1
NetRC470_2: RC470.2 UC621.1 UC621.2
NetRC478_2: RC478.2 UC621.6 UC621.7
NetRC487_2: RC487.2 UC621.8 UC621.9
NetRC496_2: RC496.2 UC621.13 UC621.14

Not connected (* = marked no-connect by the designer): SC1 1*; SC2 1*; SC3 1*; SC4 1*; SC5 1*; SC7 1*; SC8 1*

### Notes on the sheet
- 参数待更改
- (near RC447) Temperature Sensing
- (near RC448) 调改运放位号
- (near RC455) Thermal Switch Protection
- TAMB Sensing
- (near RC484) 2.5*1.2=3V
- (near CND7) To INV
- (near CNC10) To OUTPUT
- (near CND7) （30K）
- TO INPUT
- (in symbol C220U/16VSM) +
- (in symbol IC 239SM, part A) +; -
- (in symbol IC 239SM, part B) +; -
- (in symbol IC 239SM, part C) -; +
- (in symbol IC 239SM, part D) -; +
- (in symbol IC TL074SM, part A) -; TL074; (SM); +
- (in symbol IC TL074SM, part B) -; TL074; (SM); +
- (in symbol IC TL074SM, part C) -; TL074; (SM); +
- (in symbol IC TL074SM, part D) -; +
- (in symbol MOS RK7002SM) D; G; S

### Library data of the parts
CC255 CC265 CC266 CC271 CC275 CC276 CC278 CC282 CC283 CC287 CC319 CC321 CC323 CC327 = C0603 SM: 100nF/50V/J/X7R/0603
CC267-CC269 CC274 CC281 CC284 CC286 CC288 CC289 CC344 CC345 = C0603 SM: 1nF/50V/J/C0G/0603
CC270 CC272 = C0805 SM: 2.2uF/16V/K/X7R/0805
CC273 = C0603 SM: 100nF/50V/J/X7R/0603; PN: 023-104320-0
CC320 CC322 = C1206 SM: 10uF/16V/K/X7R/1206; Type: SMD
CC326 = C0603 SM: 10uF/6.3V/K/X7R/0805
CC346 CC347 = C0603 SM: 100pF/50V/J/C0G/0603
CNC6 = CN2.54-2*10P: Ejector header/2.54mm/2*10P/180°
CNC10 = CN2.54-2*20P: Ejector Header/2.54mm/2*20P/S/T/Long
CND7 = CN2.54-2*20P_1: Ejector Header/2.54mm/2*20P/S/T/Long
DC33 DC42 DC45-DC48 = D 1N4148W: 0.15A/75V/SOD-123; Type: 插件
DC41 DC43 DC44 = D 1N4148W: 0.2A/30V/SOD-123; Type: 插件
DC49 DC50 = D 1N4148W: Value: NC; Type: 插件
EC6 EC8 = C220U/16VSM: 220UF/16V/土20%/105℃/6.3×8.7/7000h; Type: SMD
MARK5 MARK7 MARK9 MARK11 = MARK_A: 单位: PCS; H: MM; Value: NC
MARK6 MARK8 MARK10 MARK12 = MARK_B: 单位: PCS; H: MM; Value: NC
NTCC1 = 17K NTC TTC03: NTC/10Kohm/-40℃--125℃/F/Φ3mm/30mm; Type: 插件
QC39 = TR 2222SM: PN: 061-010000-0; Value: NC
QC40 QC41 = MOS RK7002SM: 250mA/60V/SOT-23; Vendor: ROHM
QC42 = TR 2222SM: 0.6A/40VDC/SOT-23
QC43 = TR 2907SM: 0.6A/60VDC/SOT-23
RC443-RC446 RC455 RC457 RC460 = R0603SM: 1Kohm/1/10W/F/0603
RC447 RC470 RC478 RC487 RC496 = R0603SM: 499ohm/1/10W/F/0603
RC448 RC471 RC479 RC488 RC497 = R0603SM: 15Kohm/1/10W/F/0603
RC449 RC450 RC453 RC456 RC485 RC489 = R0603SM: 10Kohm/1/10W/F/0603
RC451 RC452 = R0603SM: 6.49Kohm/1/10W/F/0603
RC454 RC472 RC481 RC490 RC491 RC493-RC495 RC499 = R0603SM: 20Kohm/1/10W/F/0603
RC458 RC461 = R0603SM: 100Kohm/1/10W/F/0603
RC459 RC462 = R0603SM: PN: 011-103020-0; Value: NC/0603
RC463 RC464 = R0603SM: 499Kohm/1/10W/F/0603
RC465 RC473 RC474 = R0603SM: 4.7Kohm/1/10W/F/0603
RC466 RC467 = R0603SM: as RC206 on sheet CPU M
RC469 = R0603SM: PN: 011-303020-0; Value: NC/0603
RC477 RC480 = R0603SM_7_1_1_1: 499ohm/1/10W/F/0603
RC482 RC486 = R0603SM_7_1_1_1: 6.8Kohm/1/10W/F/0603
RC483 RC484 = R0603SM: Value: NC
RC492 = NC R0603SM: Name of Material: 厚膜电阻; PN: 011-203020-0; Assembly type: 贴片; Value: NC/0603
RC498 = R0603SM: 2Kohm/1/10W/F/0603
SC1-SC5 = SC40_M3: NC; 物料名称: M3螺丝; 单位: PCS; H: MM; Value: NC/SC40(M3)
SC7 SC8 = SC-MC: 物料名称: 塑料孔; H: MM; Value: NC
UC621 UC638 = IC TL074SM: Operational Amplifier/SOIC-14
UC622 = IC 239SM: Quad Differential Comparator/SOIC-14
ZDC1 = DZ MMSZ7V5SM: Vendor: ON SEMI; PN: 060-210100-0; Part Type: SMD; Value: NC

## Sheet Power.SchDoc
size A4
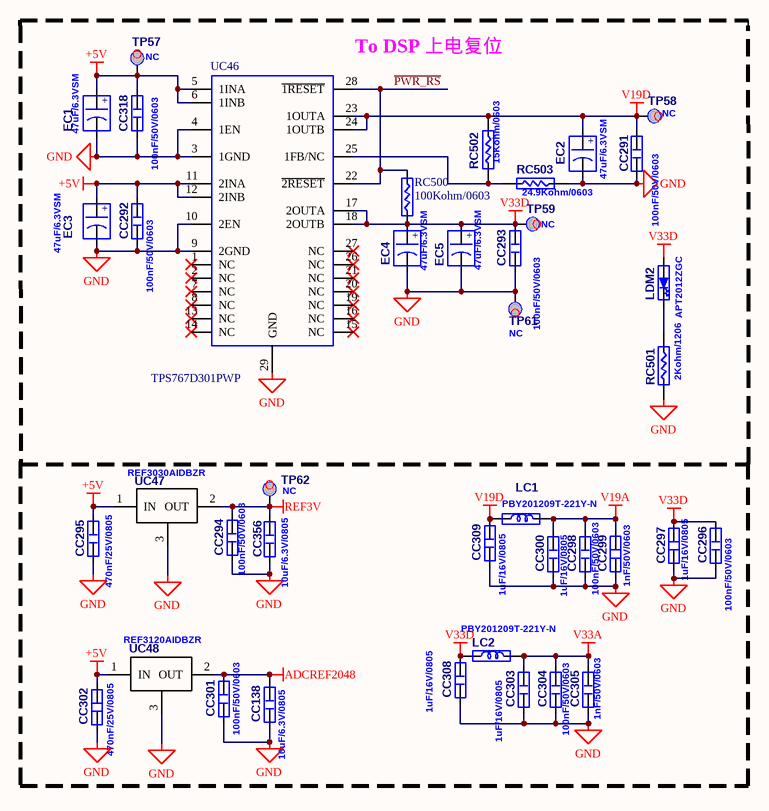
[diagram p11: Power.SchDoc]

### Parts
CC138  value 10uF/6.3V/0805  [CC2012-0805]  (hidden comment: 023-106330-0)
CC291  value 100nF/50V/0603  [CC1608-0603]  (hidden comment: 023-105220-0)
CC292  value 100nF/50V/0603  [CC1608-0603]  (hidden comment: 023-105220-0)
CC293  value 100nF/50V/0603  [CC1608-0603]  (hidden comment: 023-105220-0)
CC294  value 100nF/50V/0603  [CC1608-0603]  (hidden comment: 023-105220-0)
CC295  value 470nF/25V/0805  [CC2012-0805]  (hidden comment: 023-474250-0)
CC296  value 100nF/50V/0603  [CC1608-0603]  (hidden comment: 023-105220-0)
CC297  value 1uF/16V/0805  [CC2012-0805]  (hidden comment: 023-105330-0)
CC298  value 100nF/50V/0603  [CC1608-0603]  (hidden comment: 023-105220-0)
CC299  value 1nF/50V/0603  [CC1608-0603]  (hidden comment: 023-102220-0)
CC300  value 1uF/16V/0805  [CC2012-0805]  (hidden comment: 023-105330-0)
CC301  value 100nF/50V/0603  [CC1608-0603]  (hidden comment: 023-105220-0)
CC302  value 470nF/25V/0805  [CC2012-0805]  (hidden comment: 023-474250-0)
CC303  value 1uF/16V/0805  [CC2012-0805]  (hidden comment: 023-105330-0)
CC304  value 100nF/50V/0603  [CC1608-0603]  (hidden comment: 023-105220-0)
CC305  value 1nF/50V/0603  [CC1608-0603]  (hidden comment: 023-102220-0)
CC308  value 1uF/16V/0805  [CC2012-0805]  (hidden comment: 023-105330-0)
CC309  value 1uF/16V/0805  [CC2012-0805]  (hidden comment: 023-105330-0)
CC318  value 100nF/50V/0603  [CC1608-0603]  (hidden comment: 023-105220-0)
CC356  value 10uF/6.3V/0805  [CC2012-0805]  (hidden comment: 023-106330-0)
EC1  value 47uF/6.3VSM  [EC47UF/6.3VSM-5]  (hidden comment: 020-476003-0)
EC2  value 47uF/6.3VSM  [EC47UF/6.3VSM-5]  (hidden comment: 020-476003-0)
EC3  value 47uF/6.3VSM  [EC47UF/6.3VSM-5]  (hidden comment: 020-476003-0)
EC4  value 47uF/6.3VSM  [EC47UF/6.3VSM-5]  (hidden comment: 020-476003-0)
EC5  value 47uF/6.3VSM  [EC47UF/6.3VSM-5]  (hidden comment: 020-476003-0)
LC1  value PBY201209T-221Y-N  [L2012-0805]  (hidden comment: 080-200001-0)
LC2  value PBY201209T-221Y-N  [L2012-0805]  (hidden comment: 080-200001-0)
LDM2  value APT2012ZGC  [LED2012-0805SM]  (hidden comment: 060-011000-0)
RC500  value 100Kohm/0603  [R0603SM]  (hidden comment: 011-104020-0)
RC501  value 2Kohm/1206  [R3216-1206]  (hidden comment: 011-202050-0)
RC502  value 15Kohm/0603  [R1608-0603]  (hidden comment: 011-153020-0)
RC503  value 24.9Kohm/0603  [R1608-0603]  (hidden comment: 011-243020-0)
TP57  NC  [TEST-12]
TP58  NC  [TEST-12]
TP59  NC  [TEST-12]
TP61  NC  [TEST-12]
TP62  NC  [TEST-12]
UC46  value TPS767D301PWP  [TSSOP28-9.8X4.5-PD]  (hidden comment: 050-210100-0)
UC47  value REF3030AIDBZR  [SOT-23]  (hidden comment: 050-210111-0)
UC48  value REF3120AIDBZR  [SOT23-3]  (hidden comment: 050-210120-0)

### Blocks framed on the sheet
To DSP 上电复位: CC291-CC293 CC318 EC1-EC5 LDM2 RC500-RC503 TP57-TP59 TP61 UC46

### Nets
+5V: CC292.2 CC295.1 CC302.1 CC318.2 EC1.1 EC3.1 TP57.1 UC46.5(1INA) UC46.6(1INB) UC46.11(2INA) UC46.12(2INB) UC47.1(IN) UC48.1(IN)
ADCREF2048: CC138.2 CC301.1 UC48.2(OUT)
GND: CC138.1 CC291.2 CC292.1 CC293.2 CC294.2 CC295.2 CC296.2 CC297.1 CC298.2 CC299.2 CC300.2 CC301.2 CC302.2 CC303.1 CC304.2 CC305.1 CC308.1 CC309.1 CC318.1 CC356.1 EC1.2 EC2.2 EC3.2 EC4.2 EC5.2 RC501.1 RC503.1 TP61.1 UC46.3(1GND) UC46.4(1EN) UC46.9(2GND) UC46.10(2EN) UC46.29(GND) UC47.3 UC48.3
REF3V: CC294.1 CC356.2 TP62.1 UC47.2(OUT)
V19A: CC298.1 CC299.1 CC300.1 LC1.2
V19D: CC291.1 CC309.2 EC2.1 LC1.1 RC502.2 TP58.1 UC46.23(1OUTA) UC46.24(1OUTB)
V33A: CC303.2 CC304.1 CC305.2 LC2.2
V33D: CC293.1 CC296.1 CC297.2 CC308.2 EC4.1 EC5.1 LC2.1 LDM2.1 RC500.1 TP59.1 UC46.17(2OUTA) UC46.18(2OUTB)
~{PWR_RS}: RC500.2 UC46.22(~{2RESET}) UC46.28(~{1RESET})
NetLDM2_2: LDM2.2 RC501.2
NetRC502_1: RC502.1 RC503.2 UC46.25(1FB/NC)

Not connected (* = marked no-connect by the designer): UC46 1(NC)* 2(NC)* 7(NC)* 8(NC)* 13(NC)* 14(NC)* 15(NC)* 16(NC)* 19(NC)* 20(NC)* 21(NC)* 26(NC)* 27(NC)*

### Notes on the sheet
- (in symbol C47U/6.3VSM) +

### Library data of the parts
CC138 CC356 = C0603 SM: 10uF/6.3V/K/X7R/0805
CC291-CC294 CC296 CC298 CC301 CC304 CC318 = C0603 SM: 100nF/50V/J/X7R/0603
CC295 CC302 = C0805 SM: 470nF/25V/J/X7R/0805; Type: 贴片
CC297 CC300 CC303 CC308 CC309 = C0603 SM: 1uF/16V/K/X7R/0805
CC299 CC305 = C0603 SM: 1nF/50V/J/C0G/0603
EC1-EC5 = C47U/6.3VSM: 47uF/6.3V/Φ5*7/7000H/CW系列; Type: 贴片
LC1 LC2 = L0805SM: 220Ω±25%/100MHZ/20℃/0805
LDM2 = LD0805SM: 2.0*1.25*0.75mm/Green
RC500 = 011-104020-0 R0603SM: 100Kohm/1/10W/F/0603; Name of Material: 厚膜电阻; Vendor: RALEC/YAGEO; Factory model: RTT03 100KF TP/RC0603FR-07100KL; Assembly type: 贴片; PN: 011-104020-0
RC501 = R1206SM: 2Kohm/1/4W/F/1206
RC502 = R0603SM: 15Kohm/1/10W/F/0603
RC503 = R0603SM: 24.9Kohm/1/10W/F/0603
TP57-TP59 TP61 TP62 = 17K TPD: Type: 插件; Value: NC
UC46 = 050-210100-0 TSSOP28-9.8X4.5-PD: Low Dropout Regulator/HTSSOP-28; Name of Material: 集成电路; Vendor: TI; Assembly type: 贴片; PN: 050-210100-0; Factory model: TPS767D301PWP
UC47 = SOT-23SM: Voltage Reference/SOT23-3
UC48 = SOT23-3: Voltage Reference/SOT23-3